# EAGLE design Fuel_Cell_Controller (EAGLE 8.4.1)

## Sheet 1 of 4: MCU
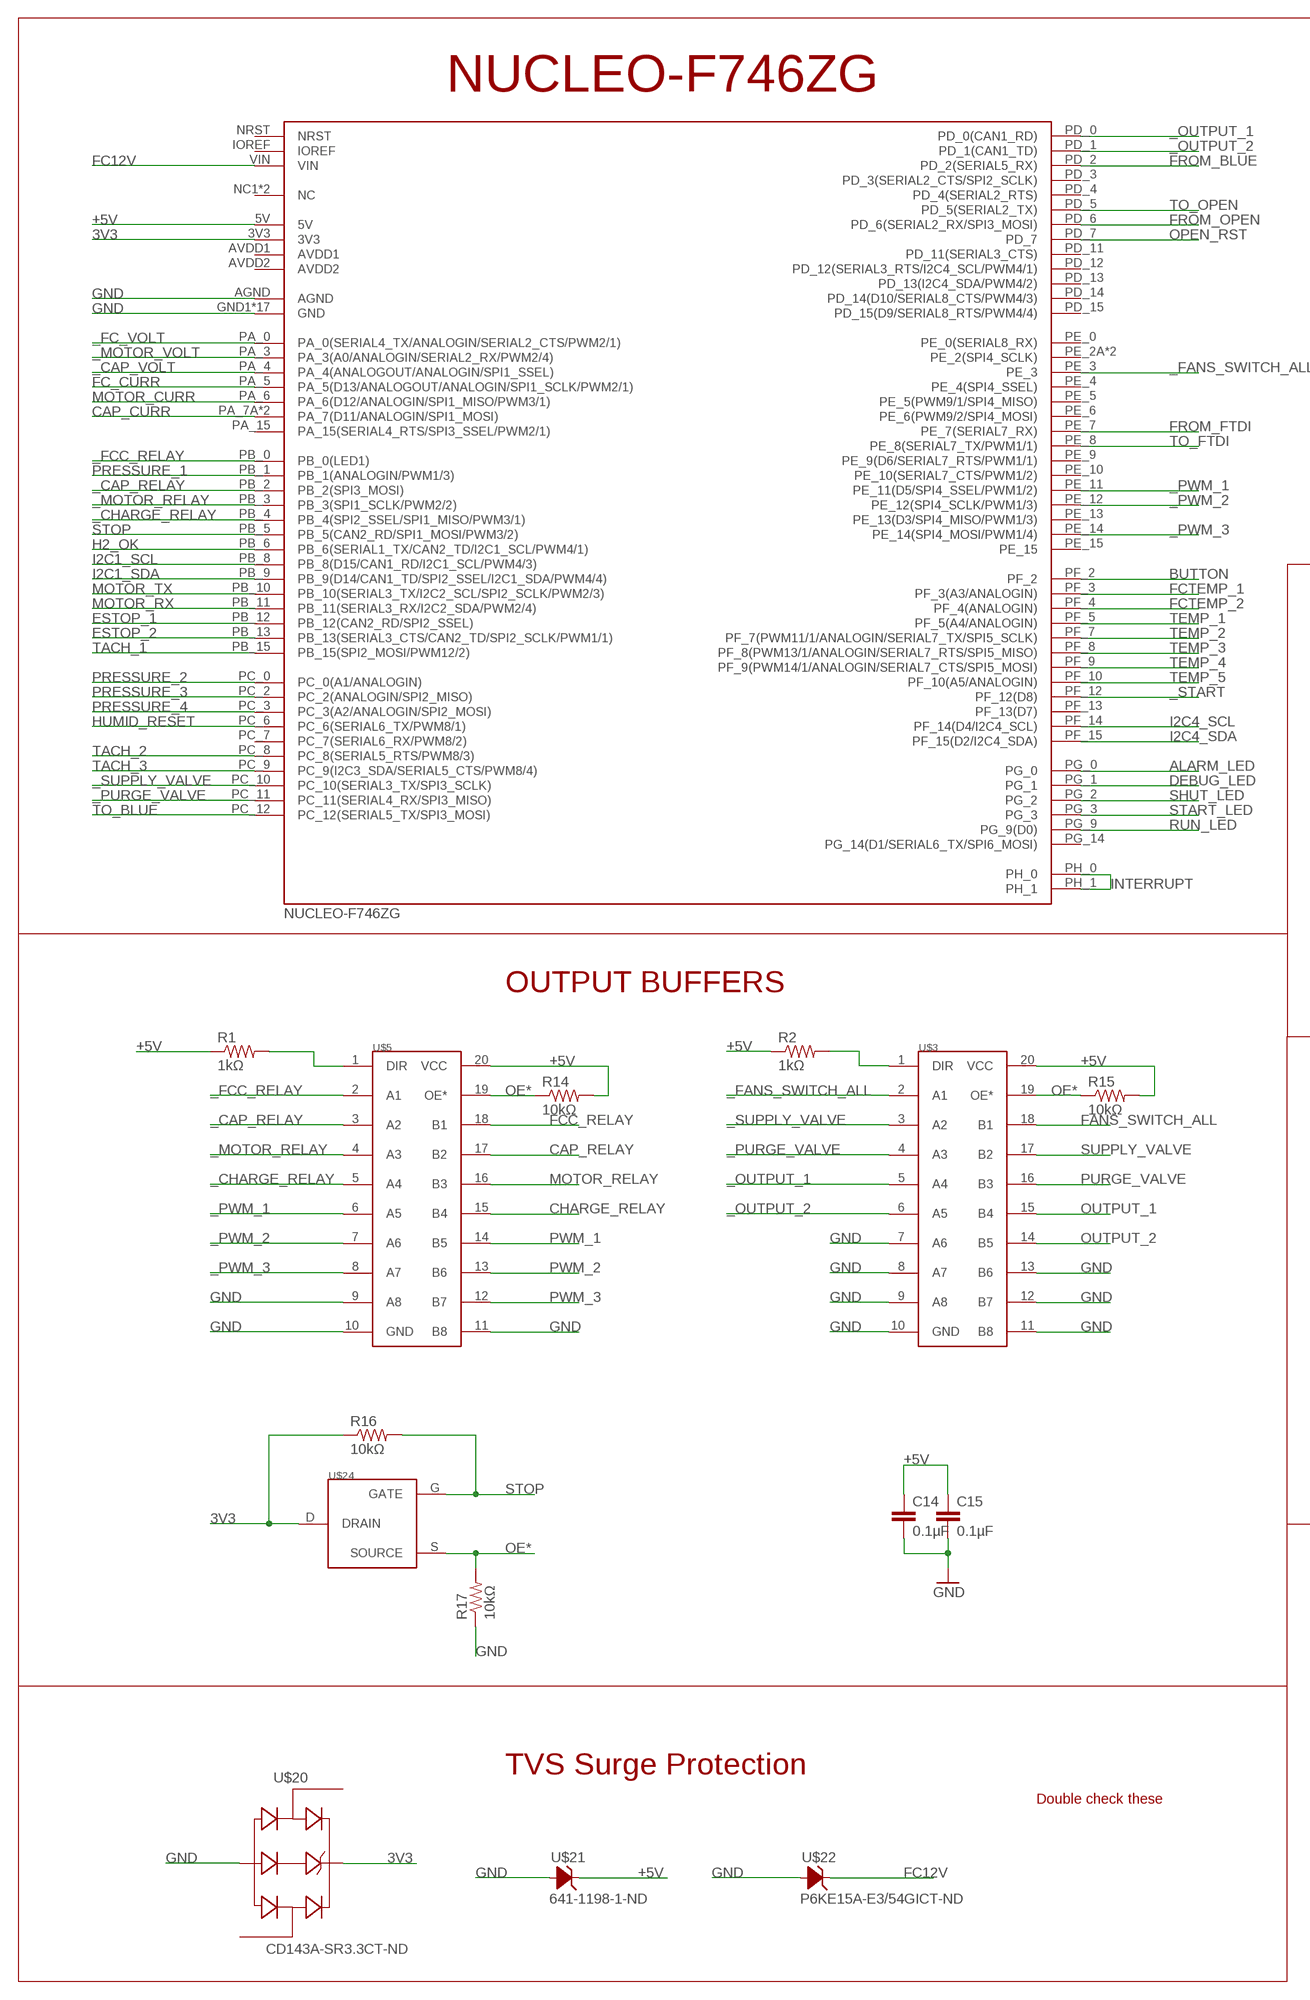
[diagram p0: schematic, sheet 1, part 1 of 2]
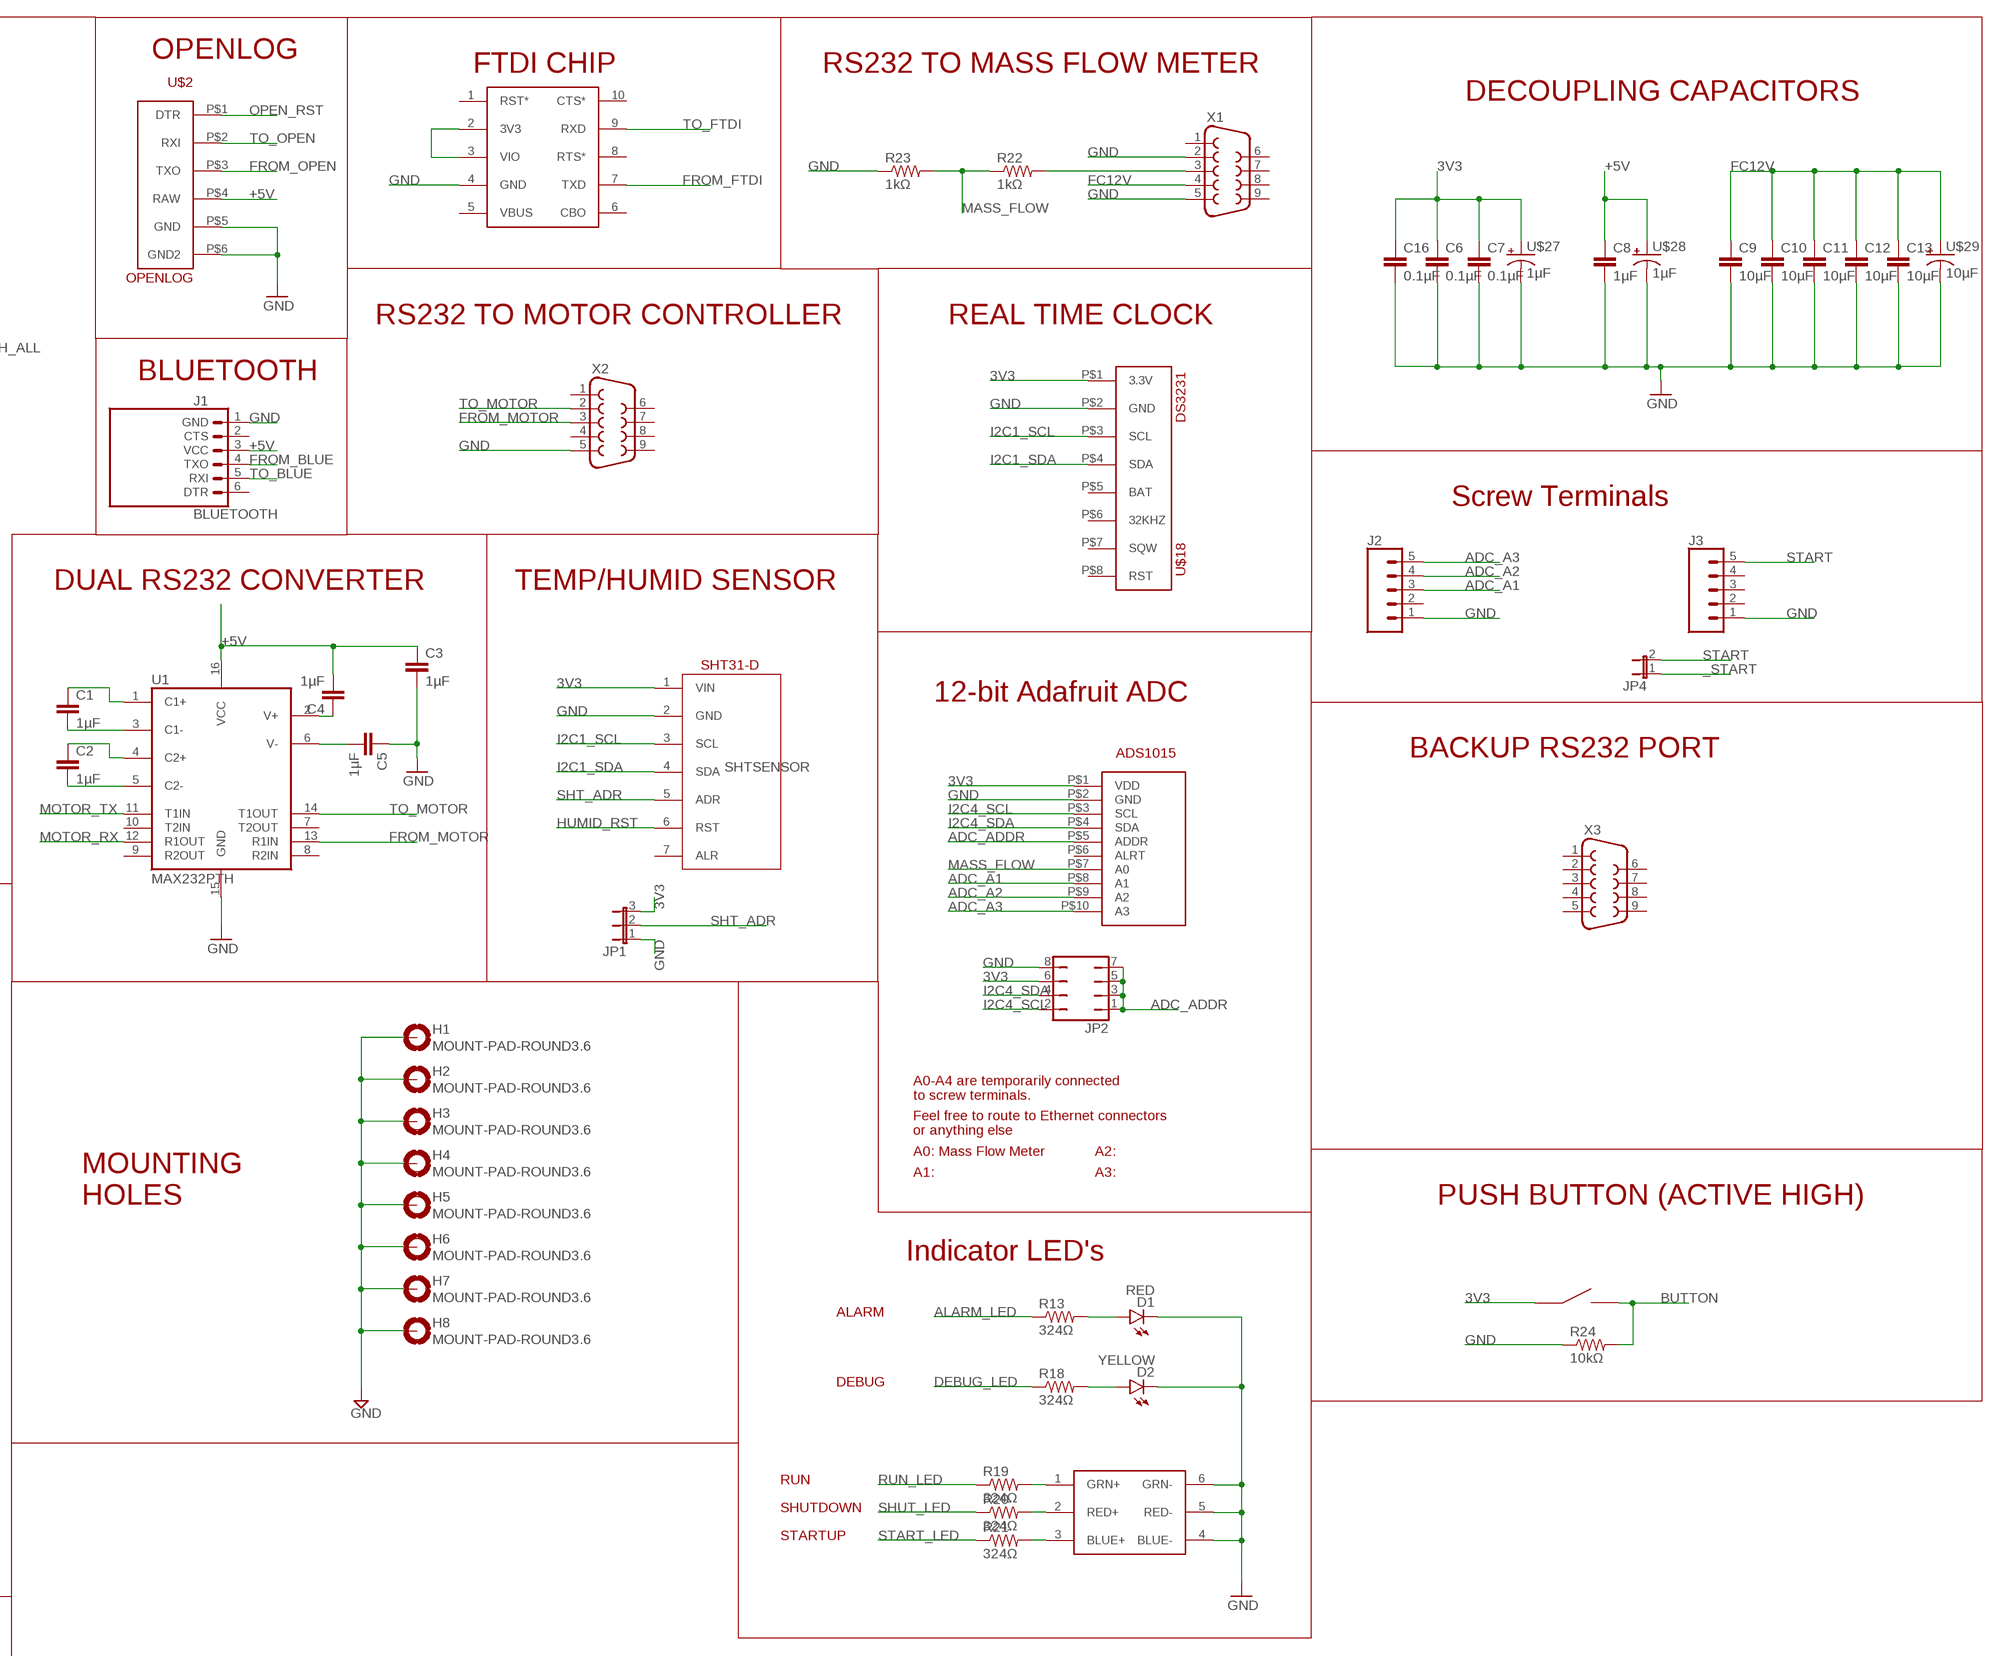
[diagram p1: schematic, sheet 1, part 2 of 2]

### Parts
C1  1µF  CAP0805  [0805]
C2  1µF  CAP0805  [0805]
C3  1µF  CAP0805  [0805]
C4  1µF  CAP0805  [0805]
C5  1µF  CAP0805  [0805]
C6  0.1µF  CAP0805  [0805]
C7  0.1µF  CAP0805  [0805]
C8  1µF  CAP0805  [0805]
C9  10µF  CAP0805  [0805]
C10  10µF  CAP0805  [0805]
C11  10µF  CAP0805  [0805]
C12  10µF  CAP0805  [0805]
C13  10µF  CAP0805  [0805]
C14  0.1µF  CAP0805  [0805]
C15  0.1µF  CAP0805  [0805]
C16  0.1µF  CAP0805  [0805]
D1  RED  LED1206  [LED-1206]
D2  YELLOW  LED1206  [LED-1206]
H1  MOUNT-PAD-ROUND3.6  [3,6-PAD]
H2  MOUNT-PAD-ROUND3.6  [3,6-PAD]
H3  MOUNT-PAD-ROUND3.6  [3,6-PAD]
H4  MOUNT-PAD-ROUND3.6  [3,6-PAD]
H5  MOUNT-PAD-ROUND3.6  [3,6-PAD]
H6  MOUNT-PAD-ROUND3.6  [3,6-PAD]
H7  MOUNT-PAD-ROUND3.6  [3,6-PAD]
H8  MOUNT-PAD-ROUND3.6  [3,6-PAD]
J1  BLUETOOTH  [1X06BLUETOOTH]
J2  CONN_05SCREW  [SCREWTERMINAL-3.5MM-5]
J3  CONN_05SCREW  [SCREWTERMINAL-3.5MM-5]
JP1  JP2E  [JP2]
JP2  JP4Q  [JP4Q]
JP4  JP1E  [JP1]
R1  1kΩ  RESISTOR0805-RES  [0805]
R2  1kΩ  RESISTOR0805-RES  [0805]
R13  324Ω  RESISTOR0805-RES  [0805]
R14  10kΩ  RESISTOR0805-RES  [0805]
R15  10kΩ  RESISTOR0805-RES  [0805]
R16  10kΩ  RESISTOR0805-RES  [0805]
R17  10kΩ  RESISTOR0805-RES  [0805]
R18  324Ω  RESISTOR0805-RES  [0805]
R19  324Ω  RESISTOR0805-RES  [0805]
R20  324Ω  RESISTOR0805-RES  [0805]
R21  324Ω  RESISTOR0805-RES  [0805]
R22  1kΩ  RESISTOR0805-RES  [0805]
R23  1kΩ  RESISTOR0805-RES  [0805]
R24  10kΩ  RESISTOR0805-RES  [0805]
SHTSENSOR  SHT31-DIS  [1X07-SHT31-DIS]
U1  MAX232PTH  [DIL16]
U$1  NUCLEO-F746ZGNUCLEO-F746ZG  [NUCLEO-F746ZG]
U$2  OPENLOG  [OPENLOG]
U$3  SN74LVC245AN  [DIL20]
U$5  SN74LVC245AN  [DIL20]
U$10  UMFT234XFUMFT234XF  [UMFT234XF]
U$18  DS3231  [DS3231]
U$19  ADS1015  [ADS1015]
U$20  CD143A-SR3.3CT-ND  [SOT143_AVAGO]
U$21  641-1198-1-ND  [SOT23]
U$22  P6KE15A-E3/54GICT-ND  [DO-204AC]
U$24  DMP3056L-7DMP3056L-7  [DMP3056L-7]
U$25  5060BRG45060BRG4  [5060BRG4]
U$26  EG4621CT-ND  [EG4621CT-ND]
U$27  1µF  CAP-VS-SERIES-PACKAGE-E(ELECT)VS-SERIES-PACKAGE-E  [PANASONIC_D]
U$28  1µF  CAP-VS-SERIES-PACKAGE-E(ELECT)VS-SERIES-PACKAGE-E  [PANASONIC_D]
U$29  10µF  CAP-VS-SERIES-PACKAGE-E(ELECT)VS-SERIES-PACKAGE-E  [PANASONIC_D]
X1  F09HP  [F09HP]
X2  F09HP  [F09HP]
X3  F09HP  [F09HP]

### Nets
3V3: C6.1 C7.1 C16.1 JP1.3 JP2.6 R16.1 SHTSENSOR.1(VIN) U$1.3V3 U$18.P$1(3.3V) U$19.P$1(VDD) U$20.VDD U$24.D(DRAIN) U$26.P$1 U$26.P$2 U$27.+
+5V: C3.1 C4.2 C8.1 C14.1 C15.1 J1.3(VCC) R1.1 R2.1 R14.2 R15.2 U1.16(VCC) U$1.5V U$2.P$4(RAW) U$3.20(VCC) U$5.20(VCC) U$21.C U$28.+ ; also sheet 4
_CAP_RELAY: U$1.PB_2(PB_2(SPI3_MOSI)) U$5.3(A2)
_CAP_VOLT: U$1.PA_4(PA_4(ANALOGOUT/ANALOGIN/SPI1_SSEL)) ; also sheet 4
_CHARGE_RELAY: U$1.PB_4(PB_4(SPI2_SSEL/SPI1_MISO/PWM3/1)) U$5.5(A4)
_FANS_SWITCH_ALL: U$1.PE_3 U$3.2(A1)
_FC_VOLT: U$1.PA_0(PA_0(SERIAL4_TX/ANALOGIN/SERIAL2_CTS/PWM2/1)) ; also sheet 4
_FCC_RELAY: U$1.PB_0(PB_0(LED1)) U$5.2(A1)
_MOTOR_RELAY: U$1.PB_3(PB_3(SPI1_SCLK/PWM2/2)) U$5.4(A3)
_MOTOR_VOLT: U$1.PA_3(PA_3(A0/ANALOGIN/SERIAL2_RX/PWM2/4)) ; also sheet 4
_OUTPUT_1: U$1.PD_0(PD_0(CAN1_RD)) U$3.5(A4)
_OUTPUT_2: U$1.PD_1(PD_1(CAN1_TD)) U$3.6(A5)
_PURGE_VALVE: U$1.PC_11(PC_11(SERIAL4_RX/SPI3_MISO)) U$3.4(A3)
_PWM_1: U$1.PE_11(PE_11(D5/SPI4_SSEL/PWM1/2)) U$5.6(A5)
_PWM_2: U$1.PE_12(PE_12(SPI4_SCLK/PWM1/3)) U$5.7(A6)
_PWM_3: U$1.PE_14(PE_14(SPI4_MOSI/PWM1/4)) U$5.8(A7)
_START: JP4.1 U$1.PF_12(PF_12(D8)) ; also sheet 2
_SUPPLY_VALVE: U$1.PC_10(PC_10(SERIAL3_TX/SPI3_SCLK)) U$3.3(A2)
ADC_A1: J2.3 U$19.P$8(A1)
ADC_A2: J2.4 U$19.P$9(A2)
ADC_A3: J2.5 U$19.P$10(A3)
ADC_ADDR: JP2.1 JP2.3 JP2.5 JP2.7 U$19.P$5(ADDR)
ALARM_LED: R13.1 U$1.PG_0
BUTTON: R24.2 U$1.PF_2 U$26.P$3 U$26.P$4
CAP_CURR: U$1.PA_7A(PA_7(D11/ANALOGIN/SPI1_MOSI)) U$1.PA_7B(PA_7(D11/ANALOGIN/SPI1_MOSI)) ; also sheet 2,4
CAP_RELAY: U$5.17(B2) ; also sheet 2
CHARGE_RELAY: U$5.15(B4) ; also sheet 2
DEBUG_LED: R18.1 U$1.PG_1
ESTOP_1: U$1.PB_12(PB_12(CAN2_RD/SPI2_SSEL)) ; also sheet 2
ESTOP_2: U$1.PB_13(PB_13(SERIAL3_CTS/CAN2_TD/SPI2_SCLK/PWM1/1)) ; also sheet 2
FANS_SWITCH_ALL: U$3.18(B1) ; also sheet 3
FC12V: C9.1 C10.1 C11.1 C12.1 C13.1 U$1.VIN U$22.CATHODE(C) U$29.+ X1.4 ; also sheet 2,3
FC_CURR: U$1.PA_5(PA_5(D13/ANALOGOUT/ANALOGIN/SPI1_SCLK/PWM2/1)) ; also sheet 2,4
FCC_RELAY: U$5.18(B1) ; also sheet 2
FCTEMP_1: U$1.PF_3(PF_3(A3/ANALOGIN)) ; also sheet 2
FCTEMP_2: U$1.PF_4(PF_4(ANALOGIN)) ; also sheet 2
FROM_BLUE: J1.4(TXO) U$1.PD_2(PD_2(SERIAL5_RX))
FROM_FTDI: U$1.PE_7(PE_7(SERIAL7_RX)) U$10.7(TXD)
FROM_MOTOR: U1.13(R1IN) X2.3
FROM_OPEN: U$1.PD_6(PD_6(SERIAL2_RX/SPI3_MOSI)) U$2.P$3(TXO)
GND: C3.2 C5.1 C6.2 C7.2 C8.2 C9.2 C10.2 C11.2 C12.2 C13.2 C14.2 C15.2 C16.2 D1.C D2.C H1.B3,6(MOUNT) H2.B3,6(MOUNT) H3.B3,6(MOUNT) H4.B3,6(MOUNT) H5.B3,6(MOUNT) H6.B3,6(MOUNT) H7.B3,6(MOUNT) H8.B3,6(MOUNT) J1.1(GND) J2.1 J3.1 JP1.1 JP2.8 R17.1 R23.1 R24.1 SHTSENSOR.2(GND) U1.15(GND) U$1.AGND U$1.GND1(GND) U$1.GND2(GND) U$1.GND3(GND) U$1.GND4(GND) U$1.GND5(GND) U$1.GND6(GND) U$1.GND7(GND) U$1.GND8(GND) U$1.GND9(GND) U$1.GND10(GND) U$1.GND11(GND) U$1.GND12(GND) U$1.GND13(GND) U$1.GND14(GND) U$1.GND15(GND) U$1.GND16(GND) U$1.GND17(GND) U$2.P$5(GND) U$2.P$6(GND2) U$3.7(A6) U$3.8(A7) U$3.9(A8) U$3.10(GND) U$3.11(B8) U$3.12(B7) U$3.13(B6) U$5.9(A8) U$5.10(GND) U$5.11(B8) U$10.4(GND) U$18.P$2(GND) U$19.P$2(GND) U$20.GND U$21.A1(A) U$21.A2(A) U$22.ANODE(A) U$25.4(BLUE-) U$25.5(RED-) U$25.6(GRN-) U$27.- U$28.- U$29.- X1.2 X1.5 X2.5 ; also sheet 2,3,4
H2_OK: U$1.PB_6(PB_6(SERIAL1_TX/CAN2_TD/I2C1_SCL/PWM4/1)) ; also sheet 2
HUMID_RESET: U$1.PC_6(PC_6(SERIAL6_TX/PWM8/1))
HUMID_RST: SHTSENSOR.6(RST)
I2C1_SCL: SHTSENSOR.3(SCL) U$1.PB_8(PB_8(D15/CAN1_RD/I2C1_SCL/PWM4/3)) U$18.P$3(SCL)
I2C1_SDA: SHTSENSOR.4(SDA) U$1.PB_9(PB_9(D14/CAN1_TD/SPI2_SSEL/I2C1_SDA/PWM4/4)) U$18.P$4(SDA)
I2C4_SCL: JP2.2 U$1.PF_14(PF_14(D4/I2C4_SCL)) U$19.P$3(SCL)
I2C4_SDA: JP2.4 U$1.PF_15(PF_15(D2/I2C4_SDA)) U$19.P$4(SDA)
INTERRUPT: U$1.PH_0 U$1.PH_1
MASS_FLOW: R22.1 R23.2 U$19.P$7(A0)
MOTOR_CURR: U$1.PA_6(PA_6(D12/ANALOGIN/SPI1_MISO/PWM3/1)) ; also sheet 2,4
MOTOR_RELAY: U$5.16(B3) ; also sheet 2
MOTOR_RX: U1.12(R1OUT) U$1.PB_11(PB_11(SERIAL3_RX/I2C2_SDA/PWM2/4))
MOTOR_TX: U1.11(T1IN) U$1.PB_10(PB_10(SERIAL3_TX/I2C2_SCL/SPI2_SCLK/PWM2/3))
N$1: U$10.2(3V3) U$10.3(VIO)
N$3: C1.1 U1.1(C1+)
N$4: C1.2 U1.3(C1-)
N$5: C2.1 U1.4(C2+)
N$6: C2.2 U1.5(C2-)
N$7: C4.1 U1.2(V+)
N$8: C5.2 U1.6(V-)
N$10: R2.2 U$3.1(DIR)
N$11: R1.2 U$5.1(DIR)
N$16: D1.A R13.2
N$17: D2.A R18.2
N$18: R19.2 U$25.1(GRN+)
N$19: R20.2 U$25.2(RED+)
N$20: R21.2 U$25.3(BLUE+)
N$22: R22.2 X1.3
OE*: R14.1 R15.1 R17.2 U$3.19(OE*) U$5.19(OE*) U$24.S(SOURCE)
OPEN_RST: U$1.PD_7 U$2.P$1(DTR)
OUTPUT_1: U$3.15(B4) ; also sheet 3
OUTPUT_2: U$3.14(B5) ; also sheet 3
PRESSURE_1: U$1.PB_1(PB_1(ANALOGIN/PWM1/3)) ; also sheet 2
PRESSURE_2: U$1.PC_0(PC_0(A1/ANALOGIN)) ; also sheet 2
PRESSURE_3: U$1.PC_2(PC_2(ANALOGIN/SPI2_MISO)) ; also sheet 2
PRESSURE_4: U$1.PC_3(PC_3(A2/ANALOGIN/SPI2_MOSI)) ; also sheet 2
PURGE_VALVE: U$3.16(B3) ; also sheet 3
PWM_1: U$5.14(B5) ; also sheet 2
PWM_2: U$5.13(B6) ; also sheet 2
PWM_3: U$5.12(B7) ; also sheet 2
RUN_LED: R19.1 U$1.PG_9(PG_9(D0))
SHT_ADR: JP1.2 SHTSENSOR.5(ADR)
SHUT_LED: R20.1 U$1.PG_2
START: J3.5 JP4.2
START_LED: R21.1 U$1.PG_3
STOP: R16.2 U$1.PB_5(PB_5(CAN2_RD/SPI1_MOSI/PWM3/2)) U$24.G(GATE) ; also sheet 2
SUPPLY_VALVE: U$3.17(B2) ; also sheet 3
TACH_1: U$1.PB_15(PB_15(SPI2_MOSI/PWM12/2)) ; also sheet 2
TACH_2: U$1.PC_8(PC_8(SERIAL5_RTS/PWM8/3)) ; also sheet 2
TACH_3: U$1.PC_9(PC_9(I2C3_SDA/SERIAL5_CTS/PWM8/4)) ; also sheet 2
TEMP_1: U$1.PF_5(PF_5(A4/ANALOGIN)) ; also sheet 2
TEMP_2: U$1.PF_7(PF_7(PWM11/1/ANALOGIN/SERIAL7_TX/SPI5_SCLK)) ; also sheet 2
TEMP_3: U$1.PF_8(PF_8(PWM13/1/ANALOGIN/SERIAL7_RTS/SPI5_MISO)) ; also sheet 2
TEMP_4: U$1.PF_9(PF_9(PWM14/1/ANALOGIN/SERIAL7_CTS/SPI5_MOSI)) ; also sheet 2
TEMP_5: U$1.PF_10(PF_10(A5/ANALOGIN)) ; also sheet 2
TO_BLUE: J1.5(RXI) U$1.PC_12(PC_12(SERIAL5_TX/SPI3_MOSI))
TO_FTDI: U$1.PE_8(PE_8(SERIAL7_TX/PWM1/1)) U$10.9(RXD)
TO_MOTOR: U1.14(T1OUT) X2.2
TO_OPEN: U$1.PD_5(PD_5(SERIAL2_TX)) U$2.P$2(RXI)
Unconnected: J1.2(CTS) J1.6(DTR) J2.2 J3.2 J3.3 J3.4 SHTSENSOR.7(ALR) U1.7(T2OUT) U1.8(R2IN) U1.9(R2OUT) U1.10(T2IN) U$1.AVDD1 U$1.AVDD2 U$1.IOREF U$1.NC1(NC) U$1.NC2(NC) U$1.NRST U$1.PA_15(PA_15(SERIAL4_RTS/SPI3_SSEL/PWM2/1)) U$1.PC_7(PC_7(SERIAL6_RX/PWM8/2)) U$1.PD_3(PD_3(SERIAL2_CTS/SPI2_SCLK)) U$1.PD_4(PD_4(SERIAL2_RTS)) U$1.PD_11(PD_11(SERIAL3_CTS)) U$1.PD_12(PD_12(SERIAL3_RTS/I2C4_SCL/PWM4/1)) U$1.PD_13(PD_13(I2C4_SDA/PWM4/2)) U$1.PD_14(PD_14(D10/SERIAL8_CTS/PWM4/3)) U$1.PD_15(PD_15(D9/SERIAL8_RTS/PWM4/4)) U$1.PE_0(PE_0(SERIAL8_RX)) U$1.PE_2A(PE_2(SPI4_SCLK)) U$1.PE_2B(PE_2(SPI4_SCLK)) U$1.PE_4(PE_4(SPI4_SSEL)) U$1.PE_5(PE_5(PWM9/1/SPI4_MISO)) U$1.PE_6(PE_6(PWM9/2/SPI4_MOSI)) U$1.PE_9(PE_9(D6/SERIAL7_RTS/PWM1/1)) U$1.PE_10(PE_10(SERIAL7_CTS/PWM1/2)) U$1.PE_13(PE_13(D3/SPI4_MISO/PWM1/3)) U$1.PE_15 U$1.PF_13(PF_13(D7)) U$1.PG_14(PG_14(D1/SERIAL6_TX/SPI6_MOSI)) U$10.1(RST*) U$10.5(VBUS) U$10.6(CBO) U$10.8(RTS*) U$10.10(CTS*) U$18.P$5(BAT) U$18.P$6(32KHZ) U$18.P$7(SQW) U$18.P$8(RST) U$19.P$6(ALRT) U$20.IO1 U$20.IO3 X1.1 X1.6 X1.7 X1.8 X1.9 X2.1 X2.4 X2.6 X2.7 X2.8 X2.9 X3.1 X3.2 X3.3 X3.4 X3.5 X3.6 X3.7 X3.8 X3.9

### Notes on the sheet
- OPENLOG
- FTDI CHIP | RS232 TO MASS FLOW METER
- NUCLEO-F746ZG
- DECOUPLING CAPACITORS
- RS232 TO MOTOR CONTROLLER | REAL TIME CLOCK
- BLUETOOTH
- Screw Terminals
- DUAL RS232 CONVERTER | TEMP/HUMID SENSOR
- 12-bit Adafruit ADC
- BACKUP RS232 PORT
- OUTPUT BUFFERS
- A0-A4 are temporarily connected 
  to screw terminals.
- Feel free to route to Ethernet connectors 
  or anything else
- A0: Mass Flow Meter | A2:
- A1: | A3:
- MOUNTING
  HOLES
- PUSH BUTTON (ACTIVE HIGH)
- Indicator LED's
- ALARM
- DEBUG
- RUN
- SHUTDOWN
- STARTUP
- TVS Surge Protection
- Double check these

## Sheet 2 of 4: Ethernet I/O
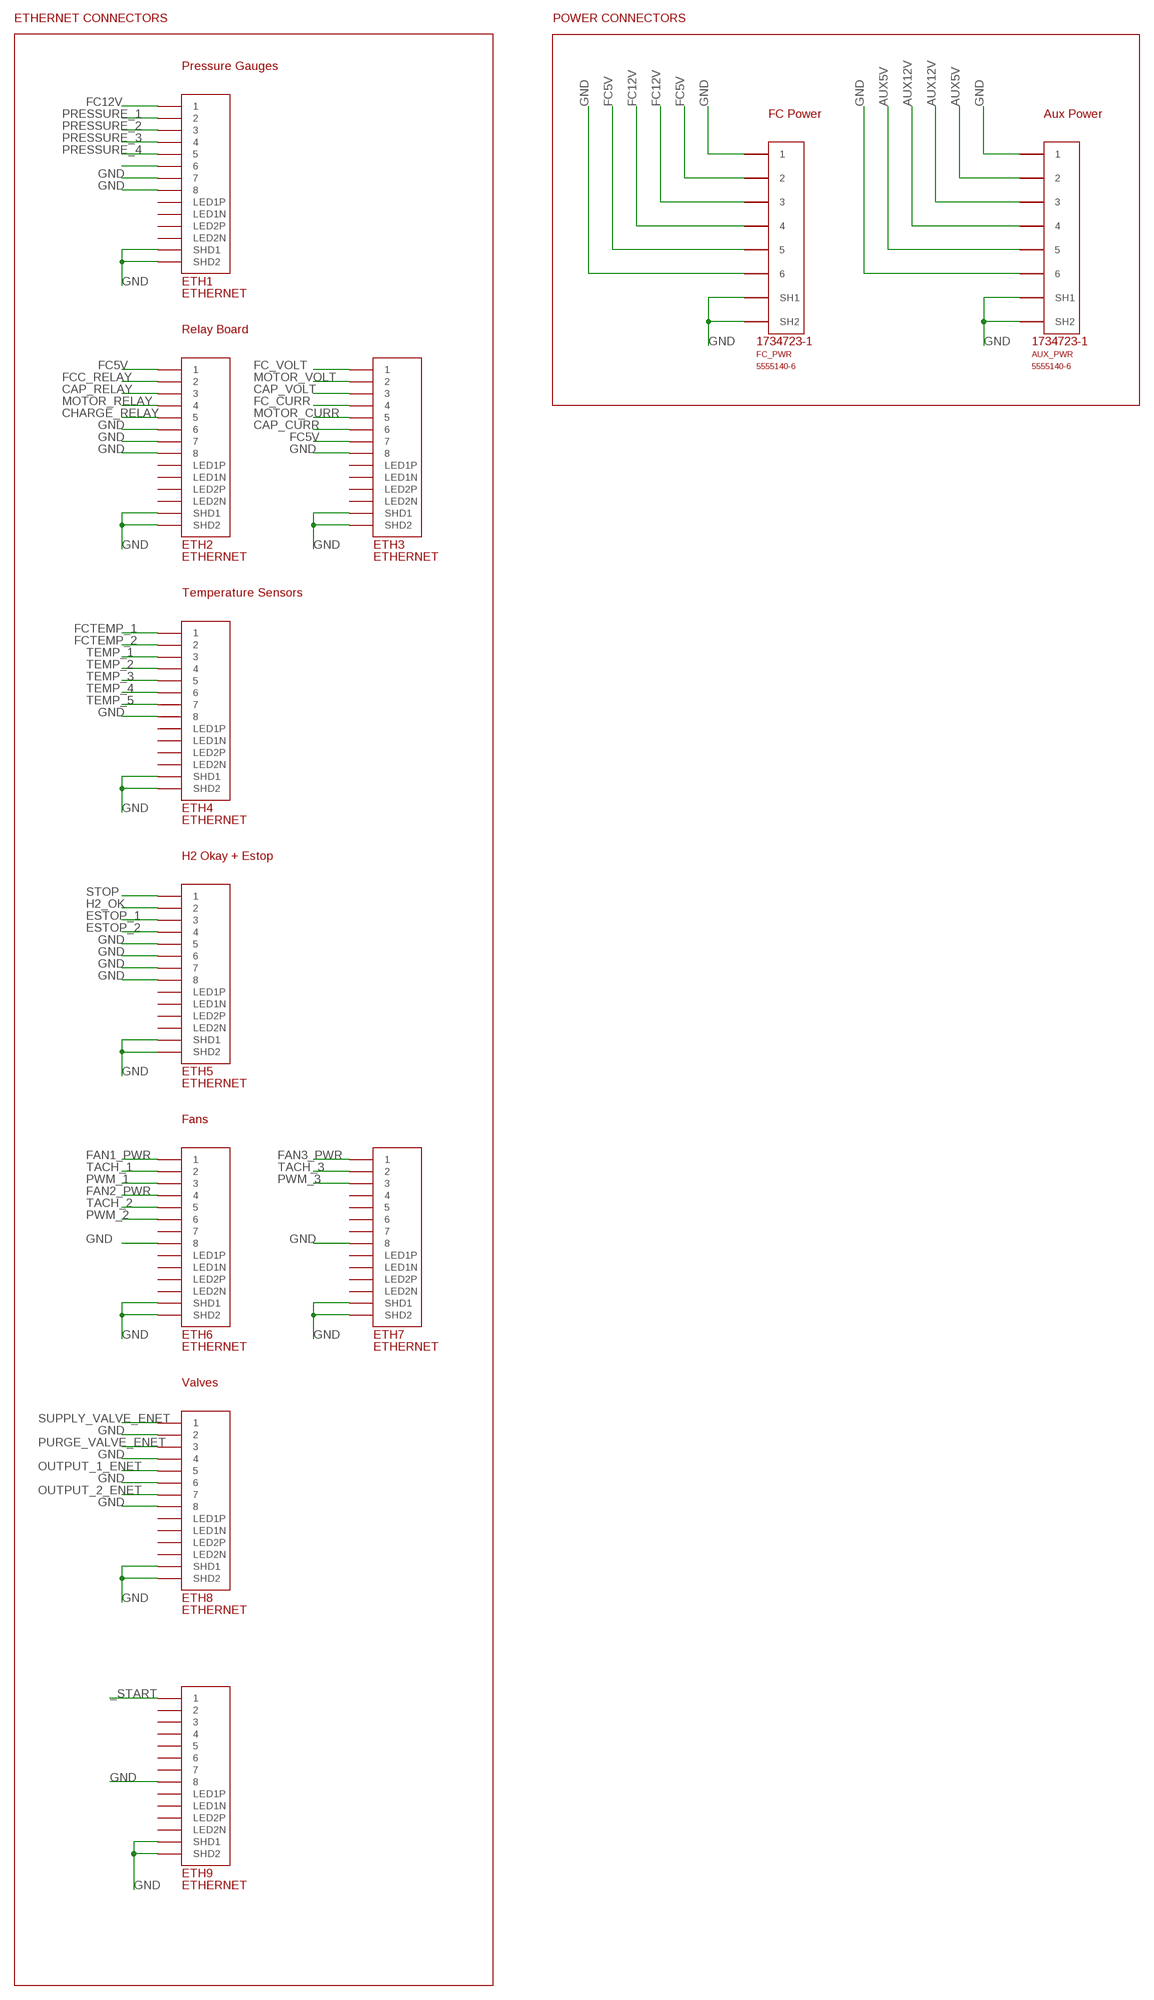
[diagram p2: schematic, sheet 2]

### Parts
AUX_PWR  5555140-6  [1734723-1_RJ11]
ETH1  ETHERNET  [A122645-ND]
ETH2  ETHERNET  [A122645-ND]
ETH3  ETHERNET  [A122645-ND]
ETH4  ETHERNET  [A122645-ND]
ETH5  ETHERNET  [A122645-ND]
ETH6  ETHERNET  [A122645-ND]
ETH7  ETHERNET  [A122645-ND]
ETH8  ETHERNET  [A122645-ND]
ETH9  ETHERNET  [A122645-ND]
FC_PWR  5555140-6  [1734723-1_RJ11]

### Nets
_START: ETH9.P$1 ; also sheet 1
AUX5V: AUX_PWR.2 AUX_PWR.5
AUX12V: AUX_PWR.3 AUX_PWR.4
CAP_CURR: ETH3.P$6 ; also sheet 1,4
CAP_RELAY: ETH2.P$3 ; also sheet 1
CAP_VOLT: ETH3.P$3 ; also sheet 4
CHARGE_RELAY: ETH2.P$5 ; also sheet 1
ESTOP_1: ETH5.P$3 ; also sheet 1
ESTOP_2: ETH5.P$4 ; also sheet 1
FAN1_PWR: ETH6.P$1 ; also sheet 3
FAN2_PWR: ETH6.P$4 ; also sheet 3
FAN3_PWR: ETH7.P$1 ; also sheet 3
FC5V: ETH2.P$1 ETH3.P$7 FC_PWR.2 FC_PWR.5
FC12V: ETH1.P$1 FC_PWR.3 FC_PWR.4 ; also sheet 1,3
FC_CURR: ETH3.P$4 ; also sheet 1,4
FC_VOLT: ETH3.P$1 ; also sheet 4
FCC_RELAY: ETH2.P$2 ; also sheet 1
FCTEMP_1: ETH4.P$1 ; also sheet 1
FCTEMP_2: ETH4.P$2 ; also sheet 1
GND: AUX_PWR.1 AUX_PWR.6 AUX_PWR.SH1 AUX_PWR.SH2 ETH1.P$7 ETH1.P$8 ETH1.P$13(SHD1) ETH1.P$14(SHD2) ETH2.P$6 ETH2.P$7 ETH2.P$8 ETH2.P$13(SHD1) ETH2.P$14(SHD2) ETH3.P$8 ETH3.P$13(SHD1) ETH3.P$14(SHD2) ETH4.P$8 ETH4.P$13(SHD1) ETH4.P$14(SHD2) ETH5.P$5 ETH5.P$6 ETH5.P$7 ETH5.P$8 ETH5.P$13(SHD1) ETH5.P$14(SHD2) ETH6.P$8 ETH6.P$13(SHD1) ETH6.P$14(SHD2) ETH7.P$8 ETH7.P$13(SHD1) ETH7.P$14(SHD2) ETH8.P$2 ETH8.P$4 ETH8.P$6 ETH8.P$8 ETH8.P$13(SHD1) ETH8.P$14(SHD2) ETH9.P$8 ETH9.P$13(SHD1) ETH9.P$14(SHD2) FC_PWR.1 FC_PWR.6 FC_PWR.SH1 FC_PWR.SH2 ; also sheet 1,3,4
H2_OK: ETH5.P$2 ; also sheet 1
MOTOR_CURR: ETH3.P$5 ; also sheet 1,4
MOTOR_RELAY: ETH2.P$4 ; also sheet 1
MOTOR_VOLT: ETH3.P$2 ; also sheet 4
N$97: ETH1.P$6
OUTPUT_1_ENET: ETH8.P$5 ; also sheet 3
OUTPUT_2_ENET: ETH8.P$7 ; also sheet 3
PRESSURE_1: ETH1.P$2 ; also sheet 1
PRESSURE_2: ETH1.P$3 ; also sheet 1
PRESSURE_3: ETH1.P$4 ; also sheet 1
PRESSURE_4: ETH1.P$5 ; also sheet 1
PURGE_VALVE_ENET: ETH8.P$3 ; also sheet 3
PWM_1: ETH6.P$3 ; also sheet 1
PWM_2: ETH6.P$6 ; also sheet 1
PWM_3: ETH7.P$3 ; also sheet 1
STOP: ETH5.P$1 ; also sheet 1
SUPPLY_VALVE_ENET: ETH8.P$1 ; also sheet 3
TACH_1: ETH6.P$2 ; also sheet 1
TACH_2: ETH6.P$5 ; also sheet 1
TACH_3: ETH7.P$2 ; also sheet 1
TEMP_1: ETH4.P$3 ; also sheet 1
TEMP_2: ETH4.P$4 ; also sheet 1
TEMP_3: ETH4.P$5 ; also sheet 1
TEMP_4: ETH4.P$6 ; also sheet 1
TEMP_5: ETH4.P$7 ; also sheet 1
Unconnected: ETH1.P$9(LED1N) ETH1.P$10(LED1P) ETH1.P$11(LED2N) ETH1.P$12(LED2P) ETH2.P$9(LED1N) ETH2.P$10(LED1P) ETH2.P$11(LED2N) ETH2.P$12(LED2P) ETH3.P$9(LED1N) ETH3.P$10(LED1P) ETH3.P$11(LED2N) ETH3.P$12(LED2P) ETH4.P$9(LED1N) ETH4.P$10(LED1P) ETH4.P$11(LED2N) ETH4.P$12(LED2P) ETH5.P$9(LED1N) ETH5.P$10(LED1P) ETH5.P$11(LED2N) ETH5.P$12(LED2P) ETH6.P$7 ETH6.P$9(LED1N) ETH6.P$10(LED1P) ETH6.P$11(LED2N) ETH6.P$12(LED2P) ETH7.P$4 ETH7.P$5 ETH7.P$6 ETH7.P$7 ETH7.P$9(LED1N) ETH7.P$10(LED1P) ETH7.P$11(LED2N) ETH7.P$12(LED2P) ETH8.P$9(LED1N) ETH8.P$10(LED1P) ETH8.P$11(LED2N) ETH8.P$12(LED2P) ETH9.P$2 ETH9.P$3 ETH9.P$4 ETH9.P$5 ETH9.P$6 ETH9.P$7 ETH9.P$9(LED1N) ETH9.P$10(LED1P) ETH9.P$11(LED2N) ETH9.P$12(LED2P)

### Notes on the sheet
- ETHERNET CONNECTORS | POWER CONNECTORS
- Pressure Gauges
- FC Power | Aux Power
- Relay Board
- Temperature Sensors
- H2 Okay + Estop
- Fans
- Valves

## Sheet 3 of 4: FANS & VALVES
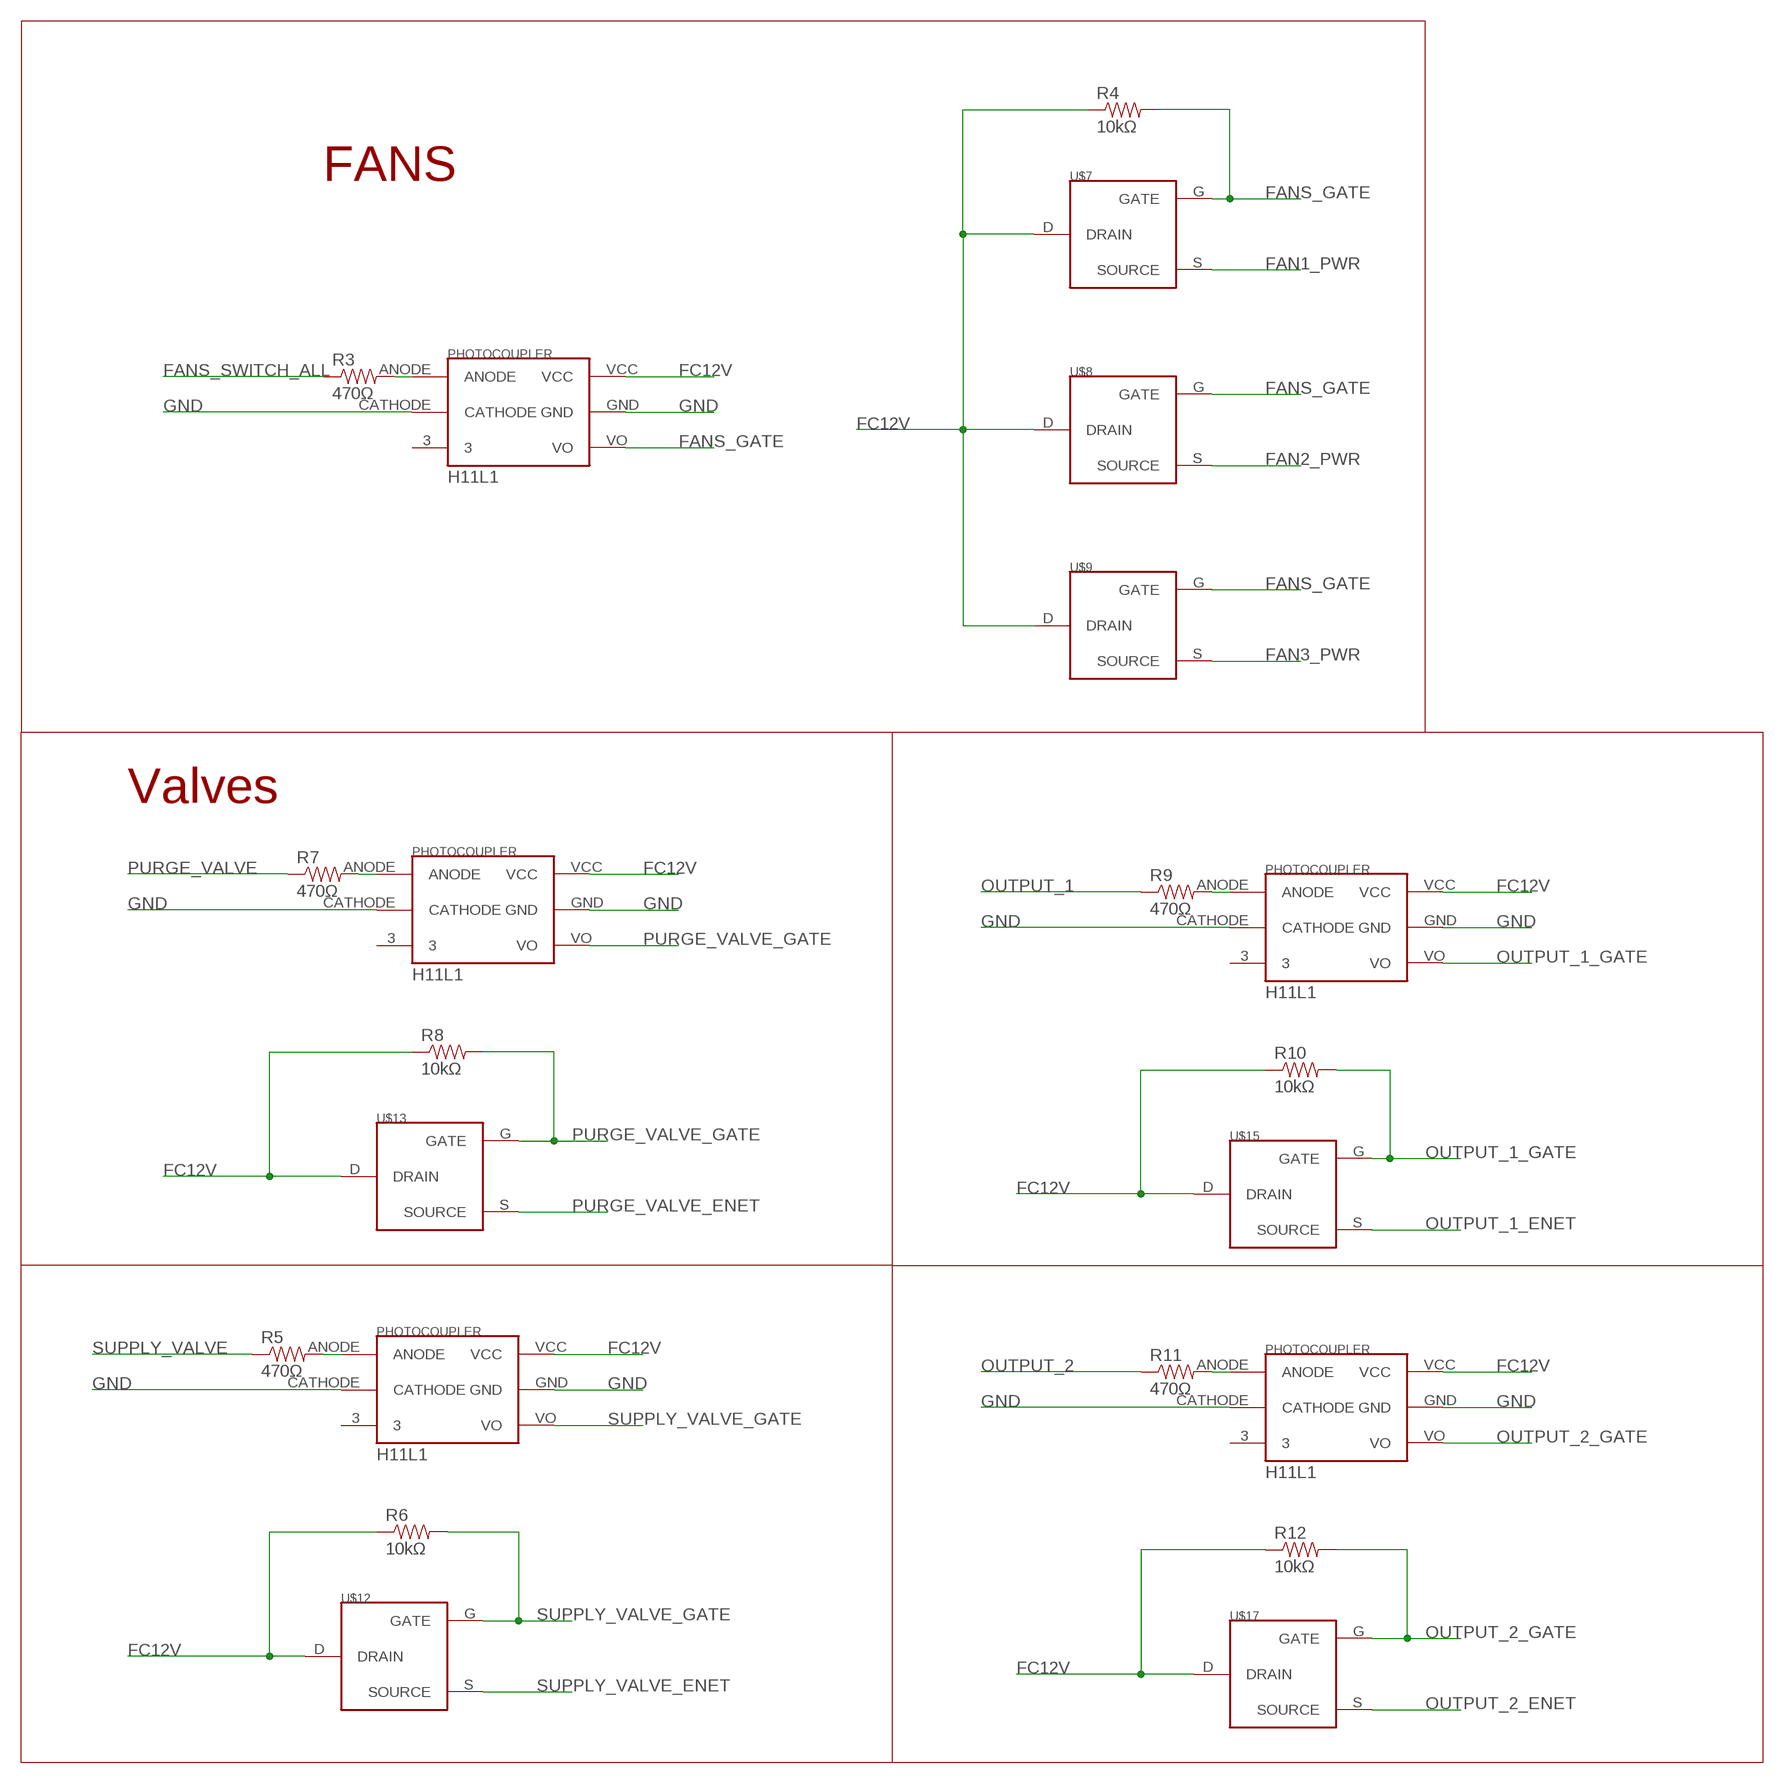
[diagram p3: schematic, sheet 3]

### Parts
R3  470Ω  RESISTOR0805-RES  [0805]
R4  10kΩ  RESISTOR0805-RES  [0805]
R5  470Ω  RESISTOR0805-RES  [0805]
R6  10kΩ  RESISTOR0805-RES  [0805]
R7  470Ω  RESISTOR0805-RES  [0805]
R8  10kΩ  RESISTOR0805-RES  [0805]
R9  470Ω  RESISTOR0805-RES  [0805]
R10  10kΩ  RESISTOR0805-RES  [0805]
R11  470Ω  RESISTOR0805-RES  [0805]
R12  10kΩ  RESISTOR0805-RES  [0805]
U$4  H11L1H11L1  [H11L1]
U$6  H11L1H11L1  [H11L1]
U$7  DMP3056L-7DMP3056L-7  [DMP3056L-7]
U$8  DMP3056L-7DMP3056L-7  [DMP3056L-7]
U$9  DMP3056L-7DMP3056L-7  [DMP3056L-7]
U$11  H11L1H11L1  [H11L1]
U$12  DMP3056L-7DMP3056L-7  [DMP3056L-7]
U$13  DMP3056L-7DMP3056L-7  [DMP3056L-7]
U$14  H11L1H11L1  [H11L1]
U$15  DMP3056L-7DMP3056L-7  [DMP3056L-7]
U$16  H11L1H11L1  [H11L1]
U$17  DMP3056L-7DMP3056L-7  [DMP3056L-7]

### Nets
FAN1_PWR: U$7.S(SOURCE) ; also sheet 2
FAN2_PWR: U$8.S(SOURCE) ; also sheet 2
FAN3_PWR: U$9.S(SOURCE) ; also sheet 2
FANS_GATE: R4.2 U$4.VO U$7.G(GATE) U$8.G(GATE) U$9.G(GATE)
FANS_SWITCH_ALL: R3.1 ; also sheet 1
FC12V: R4.1 R6.1 R8.1 R10.1 R12.1 U$4.VCC U$6.VCC U$7.D(DRAIN) U$8.D(DRAIN) U$9.D(DRAIN) U$11.VCC U$12.D(DRAIN) U$13.D(DRAIN) U$14.VCC U$15.D(DRAIN) U$16.VCC U$17.D(DRAIN) ; also sheet 1,2
GND: U$4.CATHODE U$4.GND U$6.CATHODE U$6.GND U$11.CATHODE U$11.GND U$14.CATHODE U$14.GND U$16.CATHODE U$16.GND ; also sheet 1,2,4
N$2: R5.2 U$6.ANODE
N$9: R7.2 U$11.ANODE
N$12: R3.2 U$4.ANODE
N$13: R9.2 U$14.ANODE
N$14: R11.2 U$16.ANODE
OUTPUT_1: R9.1 ; also sheet 1
OUTPUT_1_ENET: U$15.S(SOURCE) ; also sheet 2
OUTPUT_1_GATE: R10.2 U$14.VO U$15.G(GATE)
OUTPUT_2: R11.1 ; also sheet 1
OUTPUT_2_ENET: U$17.S(SOURCE) ; also sheet 2
OUTPUT_2_GATE: R12.2 U$16.VO U$17.G(GATE)
PURGE_VALVE: R7.1 ; also sheet 1
PURGE_VALVE_ENET: U$13.S(SOURCE) ; also sheet 2
PURGE_VALVE_GATE: R8.2 U$11.VO U$13.G(GATE)
SUPPLY_VALVE: R5.1 ; also sheet 1
SUPPLY_VALVE_ENET: U$12.S(SOURCE) ; also sheet 2
SUPPLY_VALVE_GATE: R6.2 U$6.VO U$12.G(GATE)
Unconnected: U$4.3 U$6.3 U$11.3 U$14.3 U$16.3

### Notes on the sheet
- FANS
- Valves

## Sheet 4 of 4: FC LP FILTER
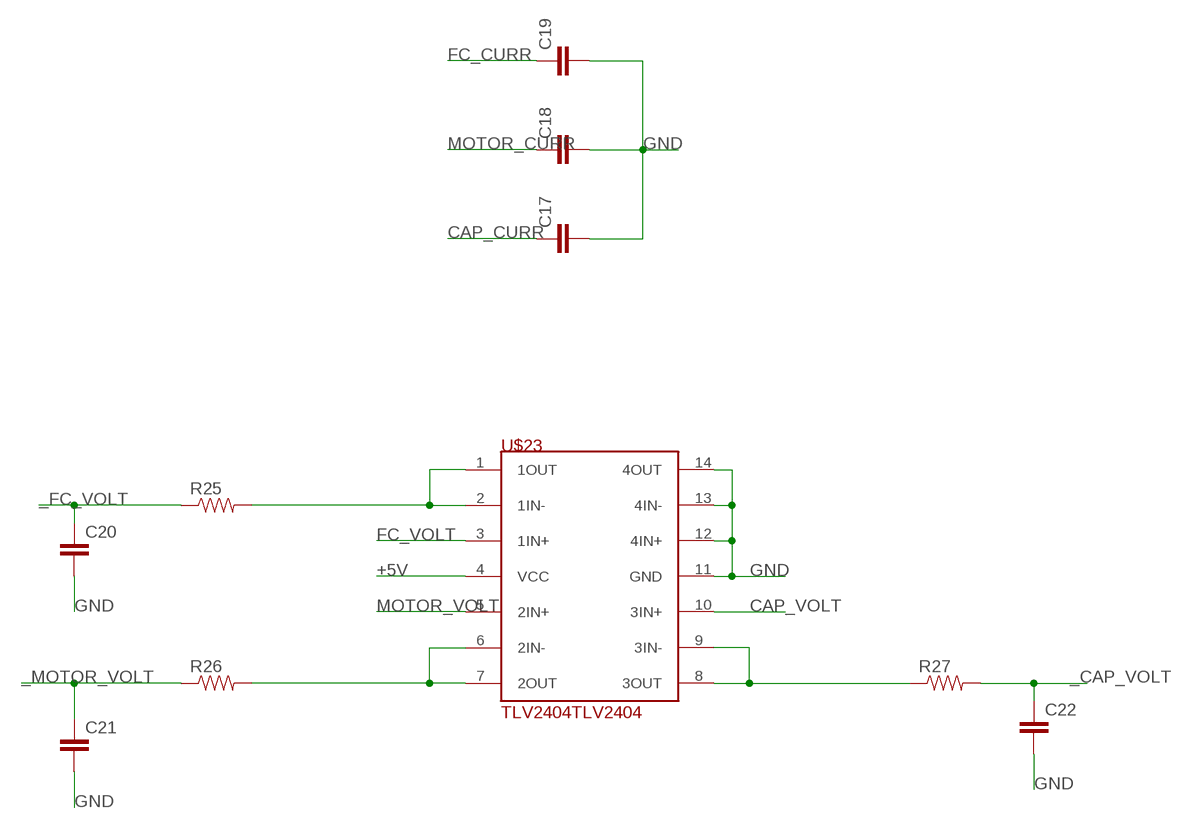
[diagram p4: schematic, sheet 4]

### Parts
C17  CAP0805  [0805]
C18  CAP0805  [0805]
C19  CAP0805  [0805]
C20  CAP0805  [0805]
C21  CAP0805  [0805]
C22  CAP0805  [0805]
R25  RESISTOR0805-RES  [0805]
R26  RESISTOR0805-RES  [0805]
R27  RESISTOR0805-RES  [0805]
U$23  TLV2404TLV2404  [DIL14]

### Nets
+5V: U$23.4(VCC) ; also sheet 1
_CAP_VOLT: C22.1 R27.2 ; also sheet 1
_FC_VOLT: C20.1 R25.1 ; also sheet 1
_MOTOR_VOLT: C21.1 R26.1 ; also sheet 1
CAP_CURR: C17.1 ; also sheet 1,2
CAP_VOLT: U$23.10(3IN+) ; also sheet 2
FC_CURR: C19.1 ; also sheet 1,2
FC_VOLT: U$23.3(1IN+) ; also sheet 2
GND: C17.2 C18.2 C19.2 C20.2 C21.2 C22.2 U$23.11(GND) U$23.12(4IN+) U$23.13(4IN-) U$23.14(4OUT) ; also sheet 1,2,3
MOTOR_CURR: C18.1 ; also sheet 1,2
MOTOR_VOLT: U$23.5(2IN+) ; also sheet 2
N$24: R25.2 U$23.1(1OUT) U$23.2(1IN-)
N$26: R26.2 U$23.6(2IN-) U$23.7(2OUT)
N$27: R27.1 U$23.8(3OUT) U$23.9(3IN-)

## Library data of the parts
AUX_PWR FC_PWR = 5555140-6 RJ11:5555140-6
C1-C5 C14 C15 = SparkFun-Passives:CAP: Capacitor Standard 0603 ceramic capacitor, and 0.1" leaded capacitor.
C6-C13 C16-C22 = SparkFun-Capacitors:CAP: Capacitor Standard 0603 ceramic capacitor, and 0.1" leaded capacitor.
D1 D2 = SparkFun-LED:LED: LEDs Standard schematic elements and footprints for 5mm, 3mm, 1206, and 0603 sized LEDs. 5mm - Spark Fun Electronics SKU : COM-00529 (and others)
ETH1-ETH9 = ETHERNET:ETHERNET: Ethernet port with 2 leds. digikey number A122645-ND
H1-H8 = holes:MOUNT-PAD-ROUND: MOUNTING PAD, round
J1 = FCC_parts:BLUETOOTH
J2 J3 = SparkFun-Connectors:CONN_05: Multi connection point. Often used as Generic Header-pin footprint for 0.1 inch spaced/style header connections On any of the 0.1 inch spaced packages, you can populate with these: Break Away Headers - Straight <https://www.sparkfun.com/products/116> (PRT-00116) Break Away Male Headers - Right Angle <https://www.sparkfun.com/products/553> (PRT-00553) Female Headers <https://www.sparkfun.com/products/115> (PRT-00115) Break Away Headers - Machine Pin <https://www.sparkfun.com/products/117> (PRT-00117) Break Away Female Headers - Swiss Machine Pin <https://www.sparkfun.com/products/743> (PRT-00743) For SCREWTERMINALS and SPRING TERMINALS visit here: Screw Terimnals on SparkFun.com <https://www.sparkfun.com/search/results?term=Screw+Terminals> (5mm/3.5mm/2.54mm spacing) This device is also useful as a general connection point to wire up your design to another part of your project. Our various solder wires solder well into these plated through hole pads. Hook-Up Wire - Assortment (Stranded, 22 AWG) <https://www.sparkfun.com/products/11375> (PRT-11375) Hook-Up Wire - Assortment (Solid Core, 22 AWG) <https://www.sparkfun.com/products/11367> (PRT-11367) View the entire wire category on our website here <https://www.sparkfun.com/categories/141> Special notes: Molex polarized connector foot print use with SKU : PRT-08231 with associated crimp pins and housings. 1MM SMD Version SKU: PRT-10208; PROD_ID: Combine 8288+8399
JP1 = jumper:JP2E: JUMPER
JP2 = jumper:JP4Q: JUMPER
JP4 = jumper:JP1E: JUMPER
R1-R24 = SparkFun-Passives:RESISTOR: Resistor Basic schematic elements and footprints for 0603, 1206, and PTH resistors.
R25-R27 = SparkFun-Resistors:RESISTOR: Resistor Basic schematic elements and footprints for 0603, 1206, and PTH resistors.
SHTSENSOR = FCC_parts:SHT31-DIS
U1 = SparkFun-DigitalIC:MAX232: RS232 Transceiver Very common IC. This is generically called 'MAX232', but works with the 3V equivalent MAX3232 generic ICs. Field tested and mother approved. Spark Fun Electronics SKU : COM-00316 (DIP) and COM-00589 (SMD)
U$1 = FCC_parts:NUCLEO-F746ZG
U$2 = openlog:OPENLOG
U$3 U$5 = FCC_parts:SN74LVC245AN
U$4 U$6 U$11 U$14 U$16 = FCC_parts:H11L1
U$7-U$9 U$12 U$13 U$15 U$17 U$24 = FCC_parts:DMP3056L-7
U$10 = FCC_parts:UMFT234XF
U$18 = DS3231:DS3231
U$19 = FCC_parts:ADS1015
U$20 = 3_3V TVS:CD143A-SR3.3CT-ND
U$21 = 5V TVS:641-1198-1-ND
U$22 = 12V TVS:P6KE15A-E3/54GICT-ND
U$23 = FCC_parts:TLV2404
U$25 = FCC_parts:5060BRG4
U$26 = EG4621CT-ND:EG4621CT-ND: surface mount push putton digikey number EG4621CT-ND
U$27-U$29 = 100uF_Cap:CAP-VS-SERIES-PACKAGE-E(ELECT)
X1-X3 = con-subd:F09: SUB-D; OC_FARNELL: unknown; OC_NEWARK: unknown

## Board
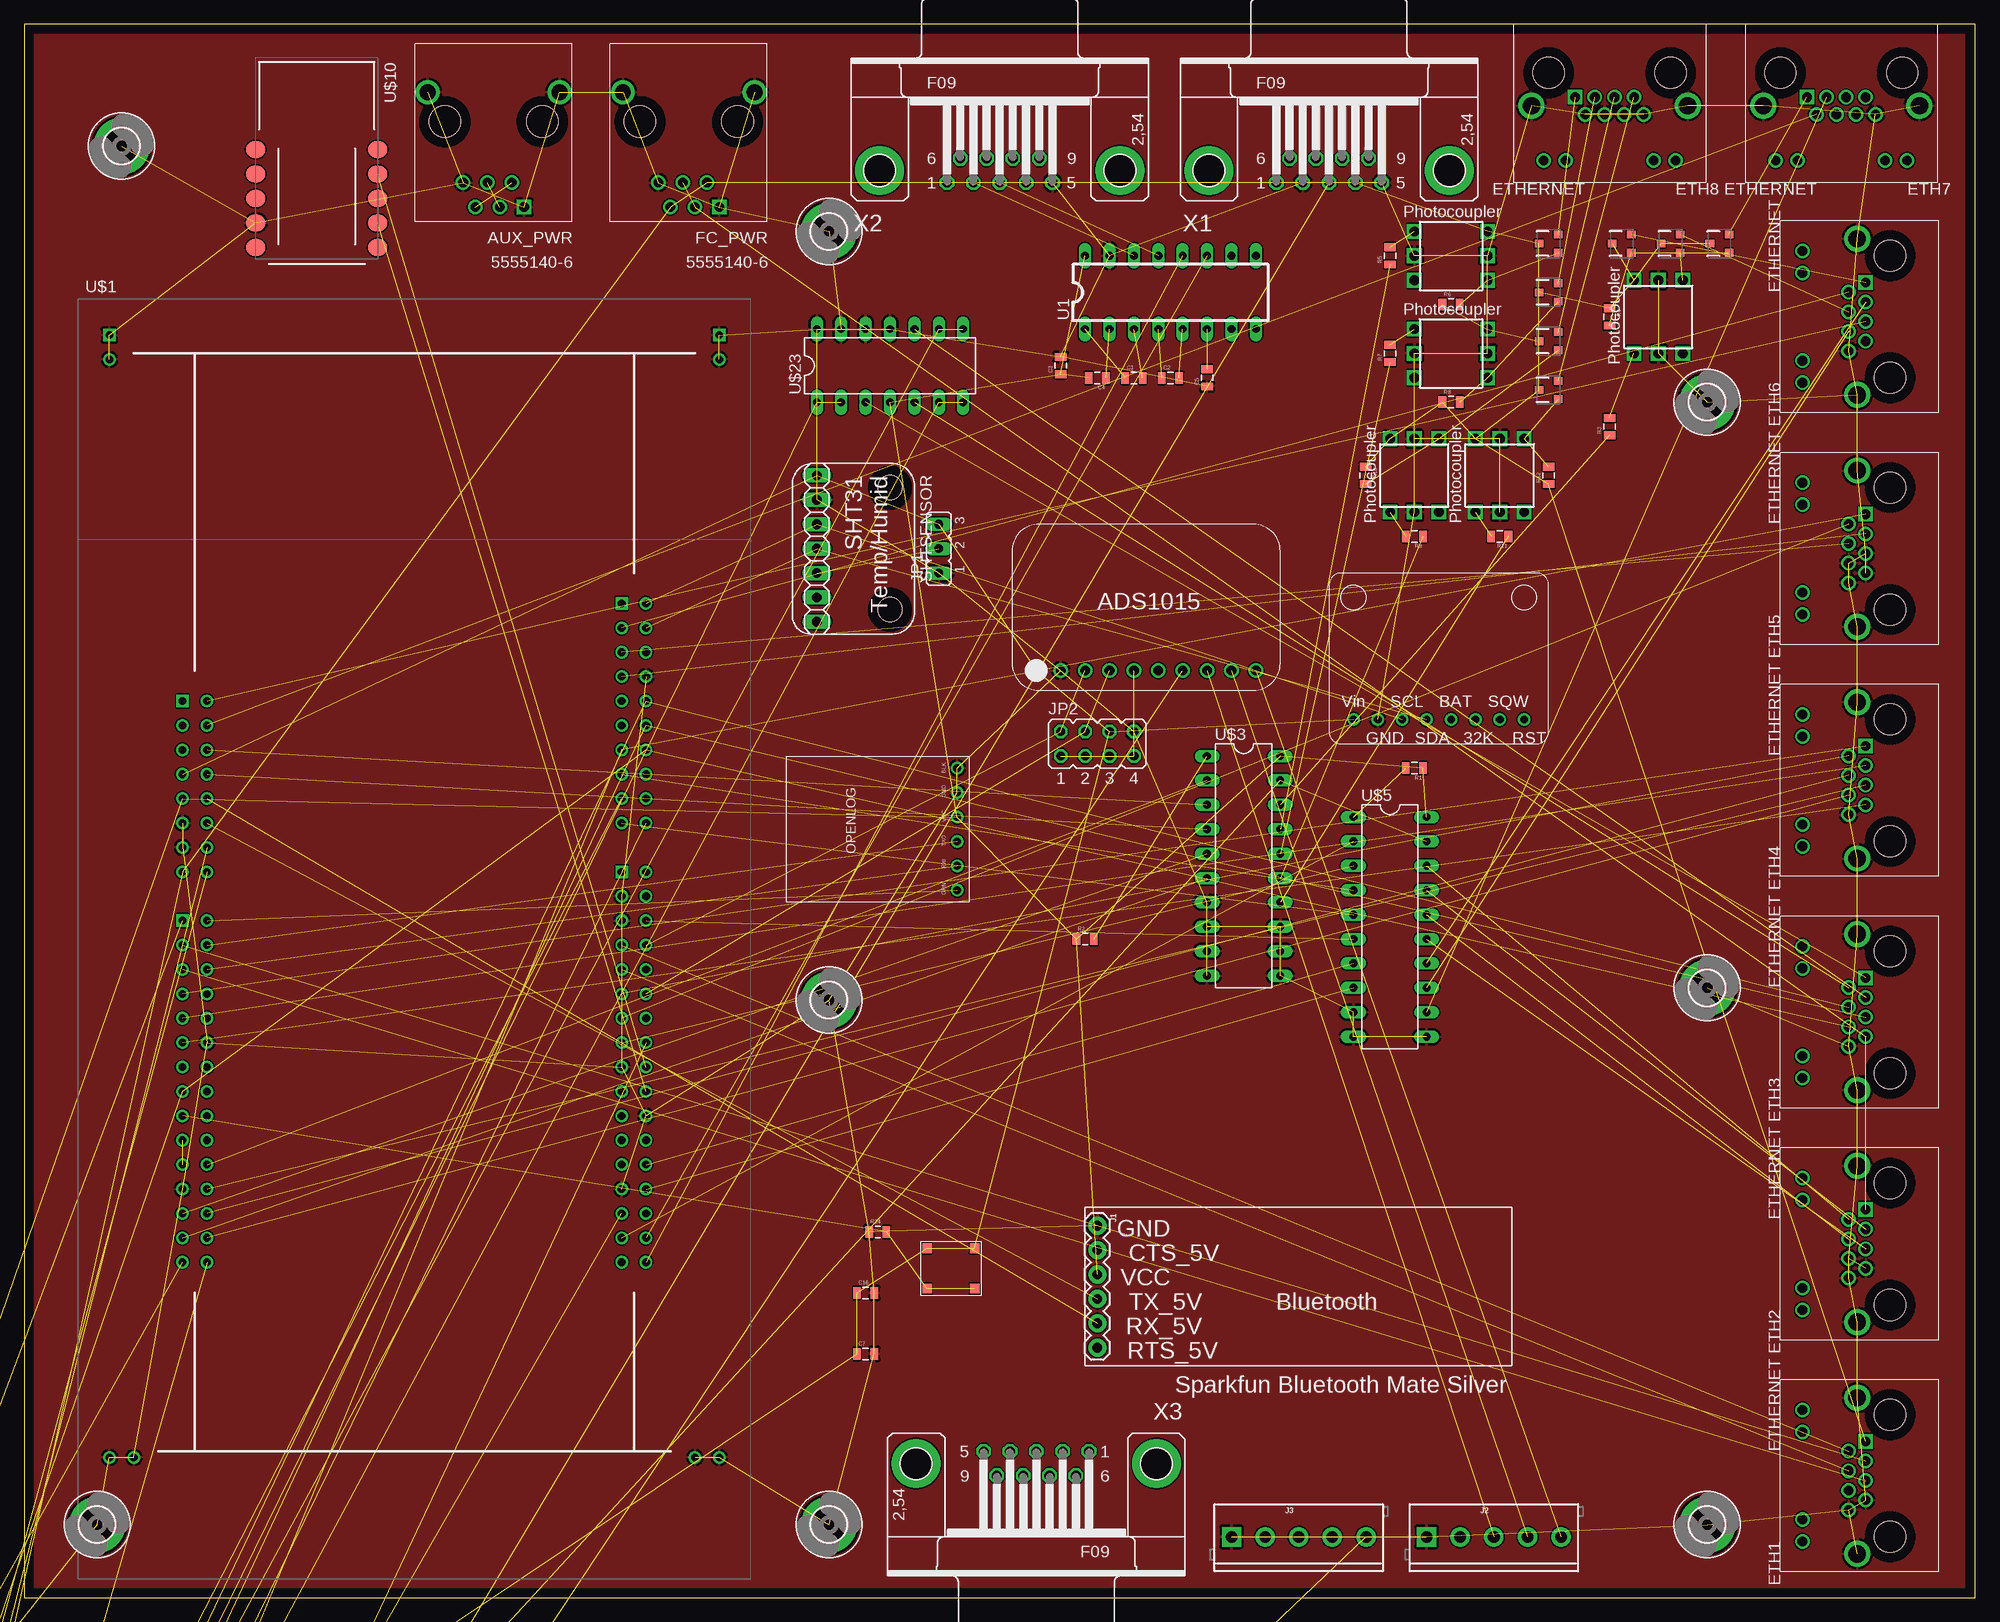
[diagram p5: board, top side]
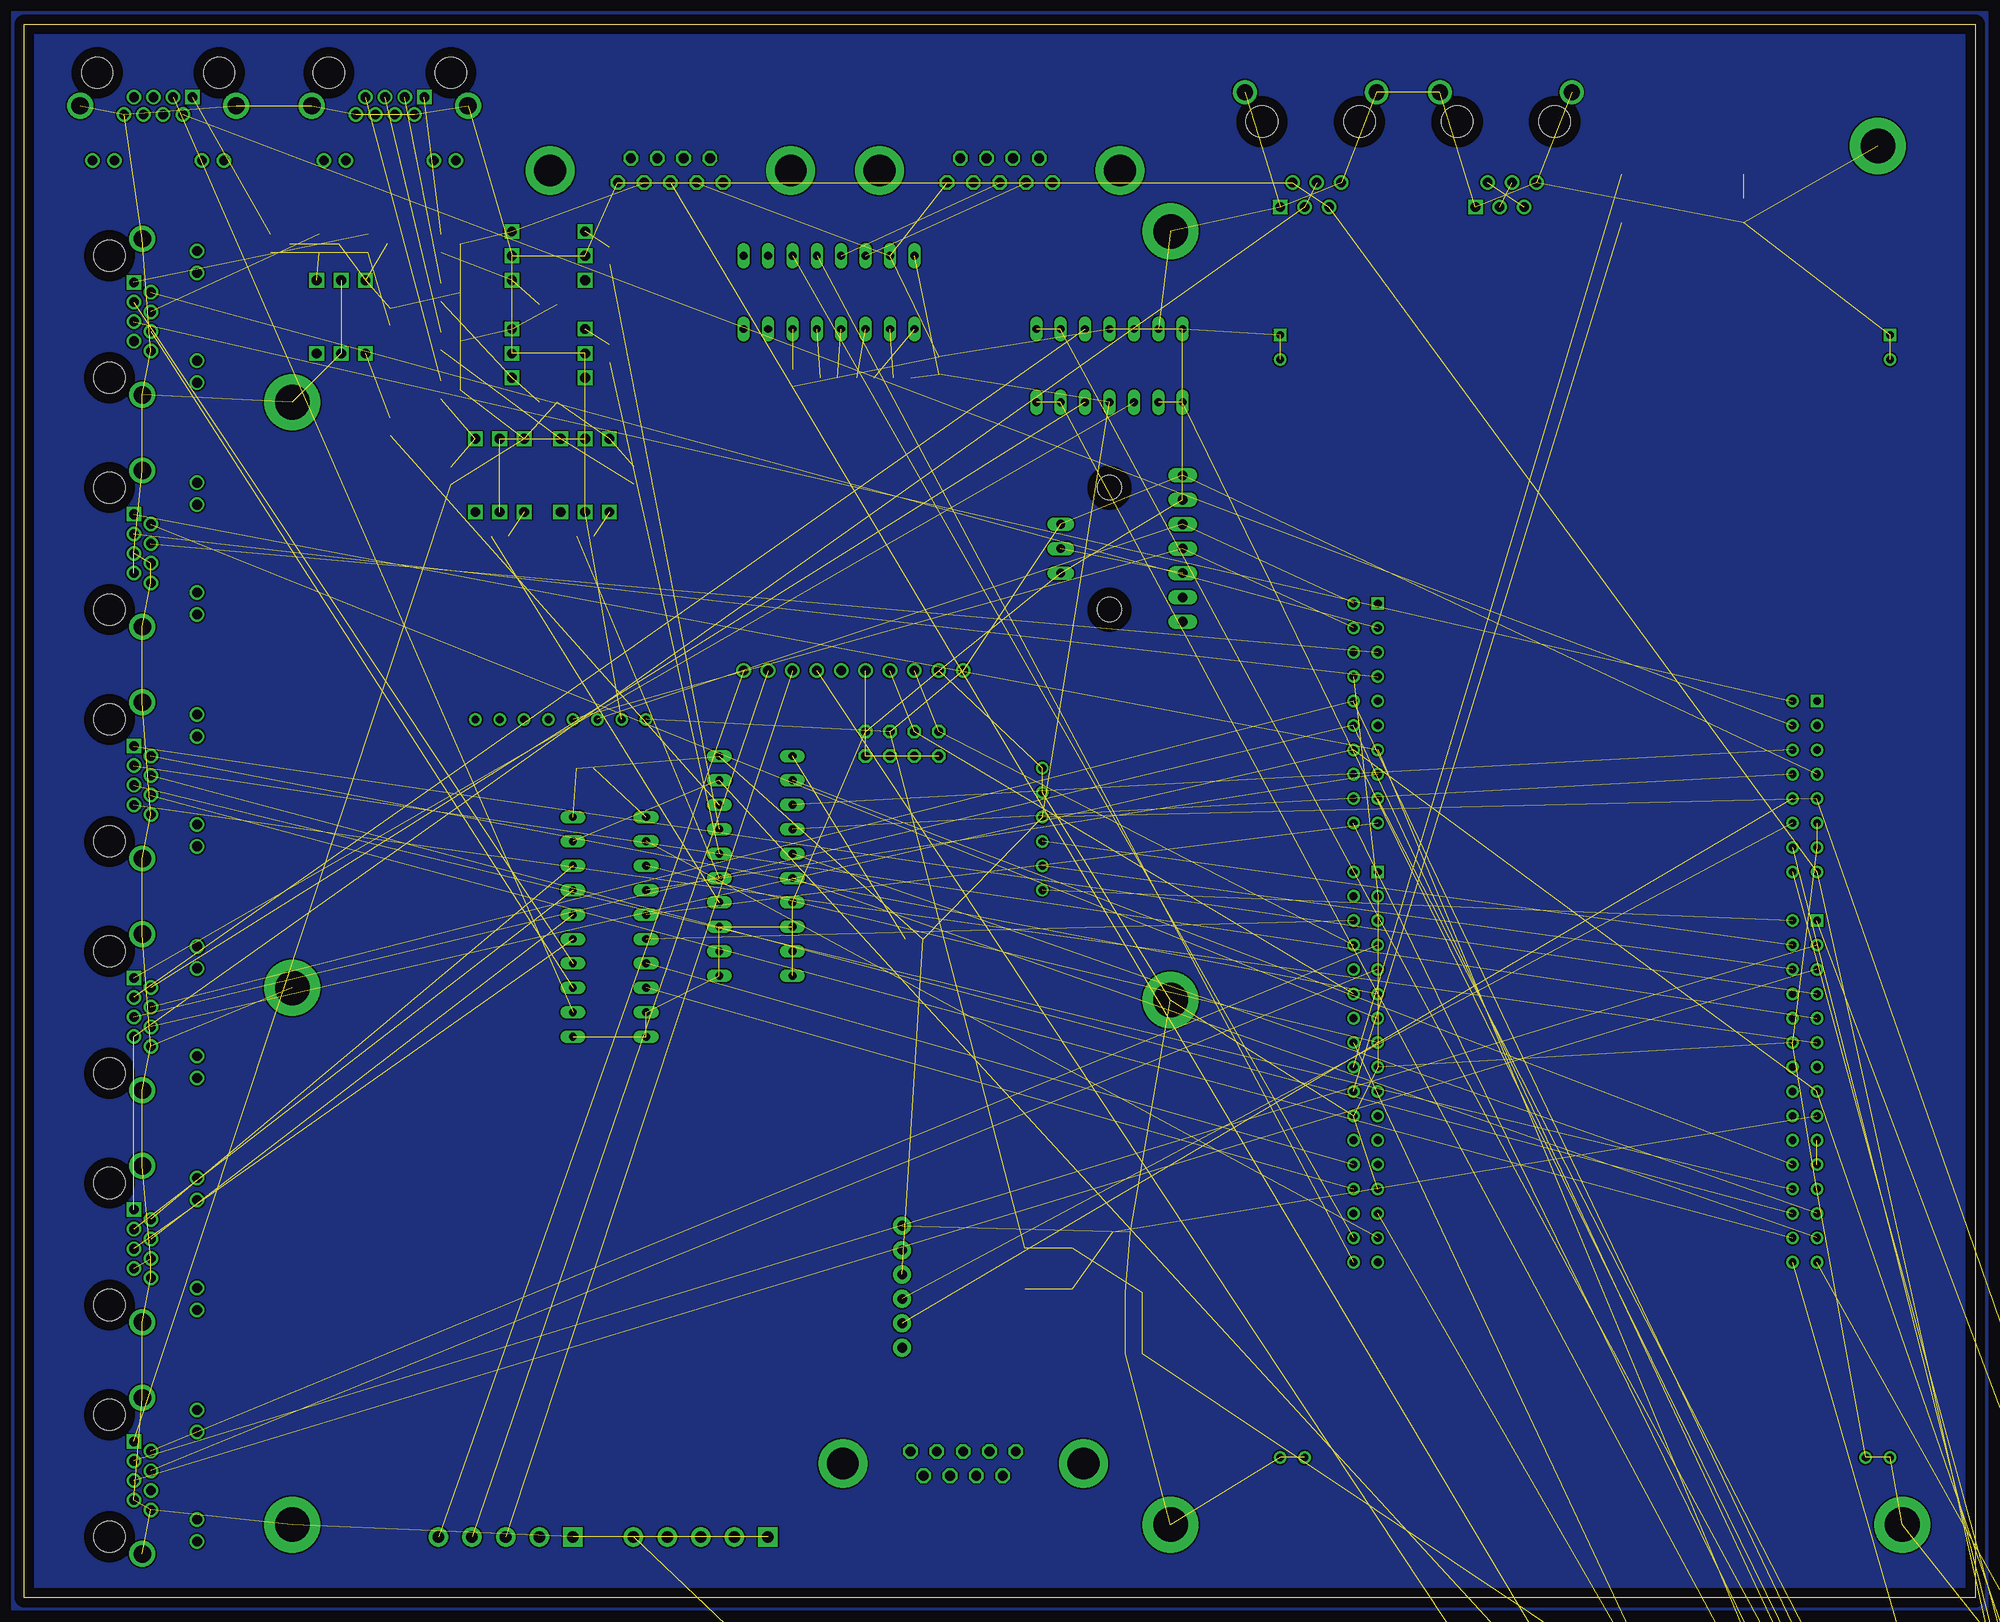
[diagram p6: board, bottom side, seen from below]

Size 203.2 x 163.83 mm. Coordinates in mm from the lower left corner, seen from the top.
Outline: 0,0 203.2,0 203.2,163.83 0,163.83 0,0
Copper layers (1*16): Top 0.035mm / dielectric 1.5mm / Bottom 0.035mm
Design rules "default": minimum track width 6mil, minimum drill 0.35mm, track to track 6mil, track to pad 6mil, pad to pad 6mil, via to via 6mil, smd to smd 6mil, copper to edge 40mil, drill to drill 6mil, minimum pad ring 10mil, minimum via ring 8mil, stop-mask expansion 4mil, vias tented up to drill 0mil, thermal gap 10mil

### Footprints (pad centres in the part's own frame; a part is rotated, then mirrored left to right if it is on the bottom)
1734723-1_RJ11 = drill 1 square: 1 -3.81,2.54 | drill 1: 2 -1.27,2.54; 3 1.27,2.54; 4 -2.54,0; 5 0,0; 6 2.54,0 | drill 1.65: SH1 -7.5,-9.4; SH2 6.22,-9.4 | hole 3.3: -5.72,-6.35; 4.44,-6.35
0805 = smd 0.8 x 1.2: 1 -0.9,0; 2 0.9,0
LED-1206 = smd 1.2 x 1.4: A -1.5,0; C 1.5,0
A122645-ND = drill 1 square: P$1 3.58,2.54 | drill 1: P$2 2.56,4.32; P$3 1.54,2.54; P$4 0.52,4.32; P$5 -0.5,2.54; P$6 -1.52,4.32; P$7 -2.54,2.54; P$8 -3.56,4.32; P$9 -6.86,9.14; P$10 -4.57,9.14; P$11 4.57,9.14; P$12 6.86,9.14 | drill 1.8: P$13 -8.13,3.43; P$14 8.13,3.43 | hole 3.25: -6.35,0; 6.35,0
3,6-PAD = drill 3.6 pad 5.842: B3,6 0,0
1X06BLUETOOTH = drill 1.016 pad 1.88: 1 43.18,1.905; 2 43.18,4.445; 3 43.18,6.985; 4 43.18,9.525; 5 43.18,12.065; 6 43.18,14.605
SCREWTERMINAL-3.5MM-5 = drill 1.2 pad 2.032 square: 1 0,0 | drill 1.2 pad 2.032: 2 3.5,0; 3 7,0; 4 10.5,0; 5 14,0
JP2 = drill 0.914 long: 1 -2.54,0; 2 0,0; 3 2.54,0
JP4Q = drill 0.914 octagon: 1 -3.81,-1.27; 2 -3.81,1.27; 3 -1.27,-1.27; 4 -1.27,1.27; 5 1.27,-1.27; 6 1.27,1.27; 7 3.81,-1.27; 8 3.81,1.27
JP1 = drill 0.914 long: 1 0,-1.27; 2 0,1.27
1X07-SHT31-DIS = drill 1.016 long: 1 -7.62,0; 2 -5.08,0; 3 -2.54,0; 4 0,0; 5 2.54,0; 6 5.08,0; 7 7.62,0 | hole 2.54: -6.35,7.62; 6.35,7.62
DIL16 = drill 0.813 long: 1 -8.89,-3.81; 2 -6.35,-3.81; 3 -3.81,-3.81; 4 -1.27,-3.81; 5 1.27,-3.81; 6 3.81,-3.81; 7 6.35,-3.81; 8 8.89,-3.81; 9 8.89,3.81; 10 6.35,3.81; 11 3.81,3.81; 12 1.27,3.81; 13 -1.27,3.81; 14 -3.81,3.81; 15 -6.35,3.81; 16 -8.89,3.81
NUCLEO-F746ZG = drill 0.8: 3V3 -24.13,17.151; 5V -24.13,14.611; AGND 21.59,4.451; AVDD1 24.13,29.851; GND1 -24.13,12.071; GND2 -24.13,9.531; GND4 -31.75,60.33; GND6 31.75,60.33; GND7 31.75,-53.969; GND8 29.21,-53.969; GND9 -29.21,-53.969; GND10 -31.75,-53.969; GND11 -24.13,-26.029; GND12 -21.59,-10.789; GND13 24.13,27.311; GND14 21.59,-13.329; GND15 21.59,-26.029; GND16 21.59,1.911; GND17 24.13,-18.409; IOREF -24.13,22.231; NC2 -24.13,-13.329; NRST -24.13,19.691; PA_0 21.59,-28.569; PA_4 21.59,14.611; PA_5 24.13,24.771; PA_6 24.13,22.231; PA_7A -24.13,-15.869; PA_7B 24.13,19.691; PA_15 21.59,24.771; PB_0 21.59,-31.109; PB_1 21.59,-0.629; PB_2 21.59,-10.789; PB_3 21.59,17.151; PB_4 21.59,12.071; PB_5 21.59,19.691; PB_6 21.59,-8.249; PB_8 24.13,34.931; PB_9 24.13,32.391; PB_10 24.13,-31.109; PB_11 24.13,-33.649; PB_12 21.59,27.311; PB_13 21.59,29.851; PB_15 21.59,32.391; PC_0 -24.13,-0.629; PC_2 21.59,-3.169; PC_3 -24.13,-3.169; PC_7 21.59,22.231; PC_8 -21.59,24.771; PC_9 -21.59,22.231; PC_10 -21.59,19.691; PC_11 -21.59,17.151; PC_12 -21.59,14.611; PD_0 -24.13,-28.569; PD_1 -24.13,-31.109; PD_2 -21.59,12.071; PD_3 -21.59,-8.249; PD_4 -21.59,-5.709; PD_5 -21.59,-3.169; PD_6 -21.59,-0.629; PD_7 -21.59,1.911; PD_11 21.59,-20.949; PD_12 21.59,-18.409; PD_13 21.59,-15.869; PD_14 24.13,17.151; PD_15 24.13,14.611; PE_0 21.59,-33.649; PE_2A -21.59,-13.329; PE_2B 21.59,-23.489; PE_3 -21.59,-23.489; PE_4 -21.59,-15.869; PE_5 -21.59,-18.409; PE_6 -21.59,-20.949; PE_7 24.13,-15.869; PE_8 24.13,-13.329; PE_9 24.13,4.451; PE_10 24.13,-20.949; PE_11 24.13,1.911; PE_12 24.13,-23.489; PE_13 24.13,-3.169; PE_14 24.13,-26.029; PE_15 24.13,-28.569; PF_2 -24.13,-18.409; PF_3 -24.13,-5.709; PF_4 21.59,-5.709; PF_5 -24.13,-8.249; PF_7 -21.59,-28.569; PF_8 -21.59,-26.029; PF_9 -21.59,-31.109; PF_10 -24.13,-10.789; PF_12 24.13,12.071; PF_13 24.13,6.991; PF_14 24.13,-0.629; PF_15 24.13,-5.709; PG_0 -24.13,-33.649; PG_1 -21.59,-33.649; PG_2 -21.59,9.531; PG_3 -21.59,6.991; PG_9 24.13,-10.789; PG_14 24.13,-8.249; PH_0 -24.13,-23.489; PH_1 -24.13,-20.949; VIN -24.13,6.991 | drill 0.8 square: AVDD2 21.59,6.991; GND3 -31.75,62.87; GND5 31.75,62.87; NC1 -24.13,24.771; PA_3 -24.13,1.911; PC_6 21.59,34.931
OPENLOG = drill 0.8: P$1 -6.35,-8.255; P$2 -3.81,-8.255; P$3 -1.27,-8.255; P$4 1.27,-8.255; P$5 3.81,-8.255; P$6 6.35,-8.255
DIL20 = drill 0.813 long: 1 -11.43,-3.81; 2 -8.89,-3.81; 3 -6.35,-3.81; 4 -3.81,-3.81; 5 -1.27,-3.81; 6 1.27,-3.81; 7 3.81,-3.81; 8 6.35,-3.81; 9 8.89,-3.81; 10 11.43,-3.81; 11 11.43,3.81; 12 8.89,3.81; 13 6.35,3.81; 14 3.81,3.81; 15 1.27,3.81; 16 -1.27,3.81; 17 -3.81,3.81; 18 -6.35,3.81; 19 -8.89,3.81; 20 -11.43,3.81
H11L1 = drill 1.016 square: 3 -3.81,-2.54; ANODE -3.81,2.54; CATHODE -3.81,0; GND 3.81,0; VCC 3.81,2.54; VO 3.81,-2.54
DMP3056L-7 = smd 0.8 x 0.9: D 0,1; G -0.95,-1; S 0.95,-1
UMFT234XF = smd 1.755 x 2.025: 1 -0.89,-6.35; 2 1.65,-6.35; 3 4.19,-6.35; 4 6.73,-6.35; 5 9.27,-6.35; 6 9.27,6.35; 7 6.73,6.35; 8 4.19,6.35; 9 1.65,6.35; 10 -0.89,6.35
DS3231 = drill 0.8: P$1 2.54,2.54; P$2 5.08,2.54; P$3 7.62,2.54; P$4 10.16,2.54; P$5 12.7,2.54; P$6 15.24,2.54; P$7 17.78,2.54; P$8 20.32,2.54
ADS1015 = drill 1.016: P$1 -11.43,0; P$2 -8.89,0; P$3 -6.35,0; P$4 -3.81,0; P$5 -1.27,0; P$6 1.27,0; P$7 3.81,0; P$8 6.35,0; P$9 8.89,0; P$10 11.43,0
SOT143_AVAGO = smd 1 x 0.7: GND -0.75,-1 | smd 0.6 x 0.7: IO1 0.95,-1; IO3 -0.95,1; VDD 0.95,1
SOT23 = smd 1 x 1.4: A1 -0.95,-1.1; A2 0.95,-1.1; C 0,1.1
DO-204AC = drill 0.95: ANODE 0,0; CATHODE 9.6,0
DIL14 = drill 0.813 long: 1 -7.62,-3.81; 2 -5.08,-3.81; 3 -2.54,-3.81; 4 0,-3.81; 5 2.54,-3.81; 6 5.08,-3.81; 7 7.62,-3.81; 8 7.62,3.81; 9 5.08,3.81; 10 2.54,3.81; 11 0,3.81; 12 -2.54,3.81; 13 -5.08,3.81; 14 -7.62,3.81
5060BRG4 = smd 2 x 1.1: 1 2.4,-1.75; 2 2.4,0; 3 2.4,1.75; 4 -2.4,1.7; 5 -2.4,0; 6 -2.4,-1.75
EG4621CT-ND = smd 1 x 1: P$1 -2.475,2.1; P$2 2.475,2.1; P$3 -2.475,-2.1; P$4 2.475,-2.1
PANASONIC_D = smd 3 x 1.4: + 2.4,0; - -2.4,0
F09HP = drill 1.016 octagon: 1 -5.486,-1.27; 2 -2.743,-1.27; 3 0,-1.27; 4 2.743,-1.27; 5 5.486,-1.27; 6 -4.115,1.27; 7 -1.372,1.27; 8 1.372,1.27; 9 4.115,1.27 | drill 3.302 pad 5.08: G1 -12.522,0; G2 12.522,0

### Placement (x,y rotation side)
AUX_PWR  48.26,147.32 180 top
C1  115.57,127 0 top
C2  119.38,127 0 top
C3  107.95,128.27 90 top
C4  111.76,127 180 top
C5  123.19,127 90 top
C6  -26.67,-66.04 0 top  (outside the outline)
C7  87.63,25.4 0 top
C8  -26.67,-71.12 0 top  (outside the outline)
C9  -26.67,-73.66 0 top  (outside the outline)
C10  -26.67,-76.2 0 top  (outside the outline)
C11  -26.67,-78.74 0 top  (outside the outline)
C12  -26.67,-81.28 0 top  (outside the outline)
C13  -26.67,-83.82 0 top  (outside the outline)
C14  -26.67,-95.25 0 top  (outside the outline)
C15  -26.67,-99.06 0 top  (outside the outline)
C16  87.63,31.75 0 top
C17  -80.01,-228.6 0 top  (outside the outline)
C18  -83.82,-228.6 0 top  (outside the outline)
C19  -87.63,-228.6 0 top  (outside the outline)
C20  -102.87,-228.6 0 top  (outside the outline)
C21  -106.68,-228.6 0 top  (outside the outline)
C22  -110.49,-228.6 0 top  (outside the outline)
D1  -19.05,-24.13 0 top  (outside the outline)
D2  -31.75,-143.51 0 top  (outside the outline)
ETH1  194.31,12.7 90 top
ETH2  194.31,36.83 90 top
ETH3  194.31,60.96 90 top
ETH4  194.31,85.09 90 top
ETH5  194.31,109.22 90 top
ETH6  194.31,133.35 90 top
ETH7  189.23,158.75 180 top
ETH8  165.1,158.75 180 top
ETH9  -55.88,-220.98 0 top  (outside the outline)
FC_PWR  68.58,147.32 180 top
H1  175.26,124.46 0 top
H2  175.26,63.5 0 top
H3  175.26,7.62 0 top
H4  83.82,7.62 0 top
H5  83.82,62.23 0 top
H6  83.82,142.24 0 top
H7  10.16,151.13 0 top
H8  7.62,7.62 0 top
J1  154.94,40.64 180 top
J2  146.05,6.35 0 top
J3  125.73,6.35 0 top
JP1  95.25,109.22 90 top
JP2  111.76,88.9 0 top
JP4  -71.12,-195.58 0 top  (outside the outline)
R1  144.78,86.36 180 top
R2  110.49,68.58 0 top
R3  165.1,121.92 90 top
R4  165.1,133.35 270 top
R5  142.24,139.7 90 top
R6  148.59,134.62 0 top
R7  142.24,129.54 90 top
R8  148.59,124.46 0 top
R9  144.78,110.49 180 top
R10  139.7,116.84 270 top
R11  153.67,110.49 180 top
R12  158.75,116.84 90 top
R13  -17.78,-27.94 0 top  (outside the outline)
R14  -26.67,-87.63 0 top  (outside the outline)
R15  -26.67,-91.44 0 top  (outside the outline)
R16  -26.67,-138.43 0 top  (outside the outline)
R17  -33.02,-138.43 0 top  (outside the outline)
R18  -33.02,-148.59 0 top  (outside the outline)
R19  -36.83,-160.02 0 top  (outside the outline)
R20  -40.64,-160.02 0 top  (outside the outline)
R21  -44.45,-160.02 0 top  (outside the outline)
R22  -48.26,-160.02 0 top  (outside the outline)
R23  -52.07,-160.02 0 top  (outside the outline)
R24  88.9,38.1 0 top
R25  -91.44,-228.6 0 top  (outside the outline)
R26  -95.25,-228.6 0 top  (outside the outline)
R27  -99.06,-228.6 0 top  (outside the outline)
SHTSENSOR  82.55,109.22 270 top
U1  119.38,135.89 0 top
U$1  40.64,68.58 0 top
U$2  88.9,80.01 90 top
U$3  127,76.2 270 top
U$4  170.18,133.35 90 top
U$5  142.24,69.85 270 top
U$6  148.59,139.7 0 top
U$7  166.37,140.97 90 top
U$8  171.45,140.97 90 top
U$9  176.53,140.97 90 top
U$10  30.48,149.86 270 top
U$11  148.59,129.54 0 top
U$12  158.75,140.97 90 top
U$13  158.75,135.89 90 top
U$14  144.78,116.84 90 top
U$15  158.75,130.81 90 top
U$16  153.67,116.84 90 top
U$17  158.75,125.73 90 top
U$18  135.89,88.9 0 top
U$19  116.84,96.52 0 top
U$20  -19.05,-45.72 0 top  (outside the outline)
U$21  -27.94,-44.45 0 top  (outside the outline)
U$22  -22.86,-57.15 0 top  (outside the outline)
U$23  90.17,128.27 0 top
U$24  -26.67,-127 0 top  (outside the outline)
U$25  -27.94,-157.48 0 top  (outside the outline)
U$26  96.52,34.29 0 top
U$27  -45.72,-167.64 0 top  (outside the outline)
U$28  -50.8,-176.53 0 top  (outside the outline)
U$29  -55.88,-185.42 0 top  (outside the outline)
X1  135.89,148.59 0 top
X2  101.6,148.59 0 top
X3  105.41,13.97 180 top

### Tracks (layer width: path | path; a pad name or v marks a point on that pad's centre or on a via)
3V3  (14 unrouted)
+5V  (17 unrouted)
_CAP_RELAY  (1 unrouted)
_CAP_VOLT  (2 unrouted)
_CHARGE_RELAY  (1 unrouted)
_FANS_SWITCH_ALL  (1 unrouted)
_FC_VOLT  (2 unrouted)
_FCC_RELAY  (1 unrouted)
_MOTOR_RELAY  (1 unrouted)
_MOTOR_VOLT  (2 unrouted)
_OUTPUT_1  (1 unrouted)
_OUTPUT_2  (1 unrouted)
_PURGE_VALVE  (1 unrouted)
_PWM_1  (1 unrouted)
_PWM_2  (1 unrouted)
_PWM_3  (1 unrouted)
_START  (2 unrouted)
_SUPPLY_VALVE  (1 unrouted)
ADC_A1  (1 unrouted)
ADC_A2  (1 unrouted)
ADC_A3  (1 unrouted)
ADC_ADDR  (4 unrouted)
ALARM_LED  (1 unrouted)
AUX5V  (1 unrouted)
AUX12V  (1 unrouted)
BUTTON  (3 unrouted)
CAP_CURR  (3 unrouted)
CAP_RELAY  (1 unrouted)
CAP_VOLT  (1 unrouted)
CHARGE_RELAY  (1 unrouted)
DEBUG_LED  (1 unrouted)
ESTOP_1  (1 unrouted)
ESTOP_2  (1 unrouted)
FAN1_PWR  (1 unrouted)
FAN2_PWR  (1 unrouted)
FAN3_PWR  (1 unrouted)
FANS_GATE  (4 unrouted)
FANS_SWITCH_ALL  (1 unrouted)
FC5V  (3 unrouted)
FC12V  (28 unrouted)
FC_CURR  (2 unrouted)
FC_VOLT  (1 unrouted)
FCC_RELAY  (1 unrouted)
FCTEMP_1  (1 unrouted)
FCTEMP_2  (1 unrouted)
FROM_BLUE  (1 unrouted)
FROM_FTDI  (1 unrouted)
FROM_MOTOR  (1 unrouted)
FROM_OPEN  (1 unrouted)
GND  (142 unrouted)
  pour Top: -1.27,165.1 -1.27,-1.27 204.47,-1.27 204.47,165.1
H2_OK  (1 unrouted)
I2C1_SCL  (2 unrouted)
I2C1_SDA  (2 unrouted)
I2C4_SCL  (2 unrouted)
I2C4_SDA  (2 unrouted)
INTERRUPT  (1 unrouted)
MASS_FLOW  (2 unrouted)
MOTOR_CURR  (2 unrouted)
MOTOR_RELAY  (1 unrouted)
MOTOR_RX  (1 unrouted)
MOTOR_TX  (1 unrouted)
MOTOR_VOLT  (1 unrouted)
N$1  (1 unrouted)
N$2  (1 unrouted)
N$3  (1 unrouted)
N$4  (1 unrouted)
N$5  (1 unrouted)
N$6  (1 unrouted)
N$7  (1 unrouted)
N$8  (1 unrouted)
N$9  (1 unrouted)
N$10  (1 unrouted)
N$11  (1 unrouted)
N$12  (1 unrouted)
N$13  (1 unrouted)
N$14  (1 unrouted)
N$15
  pour Bottom: -1.27,165.1 -1.27,-1.27 204.47,-1.27 204.47,165.1
N$16  (1 unrouted)
N$17  (1 unrouted)
N$18  (1 unrouted)
N$19  (1 unrouted)
N$20  (1 unrouted)
N$22  (1 unrouted)
N$24  (2 unrouted)
N$26  (2 unrouted)
N$27  (2 unrouted)
OE*  (5 unrouted)
OPEN_RST  (1 unrouted)
OUTPUT_1  (1 unrouted)
OUTPUT_1_ENET  (1 unrouted)
OUTPUT_1_GATE  (2 unrouted)
OUTPUT_2  (1 unrouted)
OUTPUT_2_ENET  (1 unrouted)
OUTPUT_2_GATE  (2 unrouted)
PRESSURE_1  (1 unrouted)
PRESSURE_2  (1 unrouted)
PRESSURE_3  (1 unrouted)
PRESSURE_4  (1 unrouted)
PURGE_VALVE  (1 unrouted)
PURGE_VALVE_ENET  (1 unrouted)
PURGE_VALVE_GATE  (2 unrouted)
PWM_1  (1 unrouted)
PWM_2  (1 unrouted)
PWM_3  (1 unrouted)
RUN_LED  (1 unrouted)
SHT_ADR  (1 unrouted)
SHUT_LED  (1 unrouted)
START  (1 unrouted)
START_LED  (1 unrouted)
STOP  (3 unrouted)
SUPPLY_VALVE  (1 unrouted)
SUPPLY_VALVE_ENET  (1 unrouted)
SUPPLY_VALVE_GATE  (2 unrouted)
TACH_1  (1 unrouted)
TACH_2  (1 unrouted)
TACH_3  (1 unrouted)
TEMP_1  (1 unrouted)
TEMP_2  (1 unrouted)
TEMP_3  (1 unrouted)
TEMP_4  (1 unrouted)
TEMP_5  (1 unrouted)
TO_BLUE  (1 unrouted)
TO_FTDI  (1 unrouted)
TO_MOTOR  (1 unrouted)
TO_OPEN  (1 unrouted)